# EAGLE schematic UCirKitBreadboard-08231908 (EAGLE 6.5.0), part 1 of 2
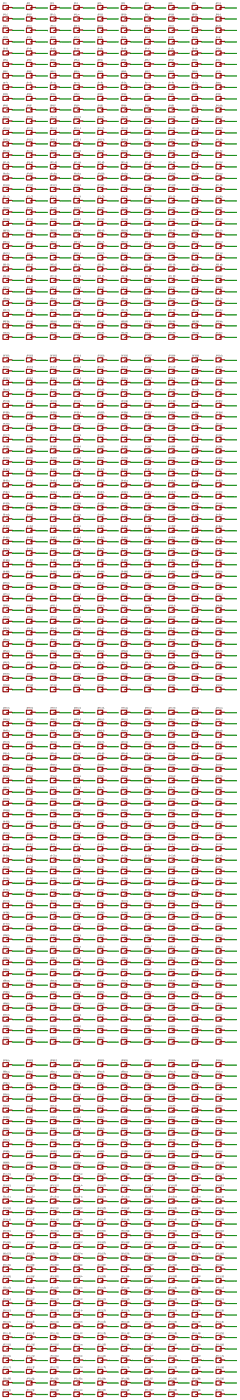
[diagram p0: schematic, sheet 1, overview]
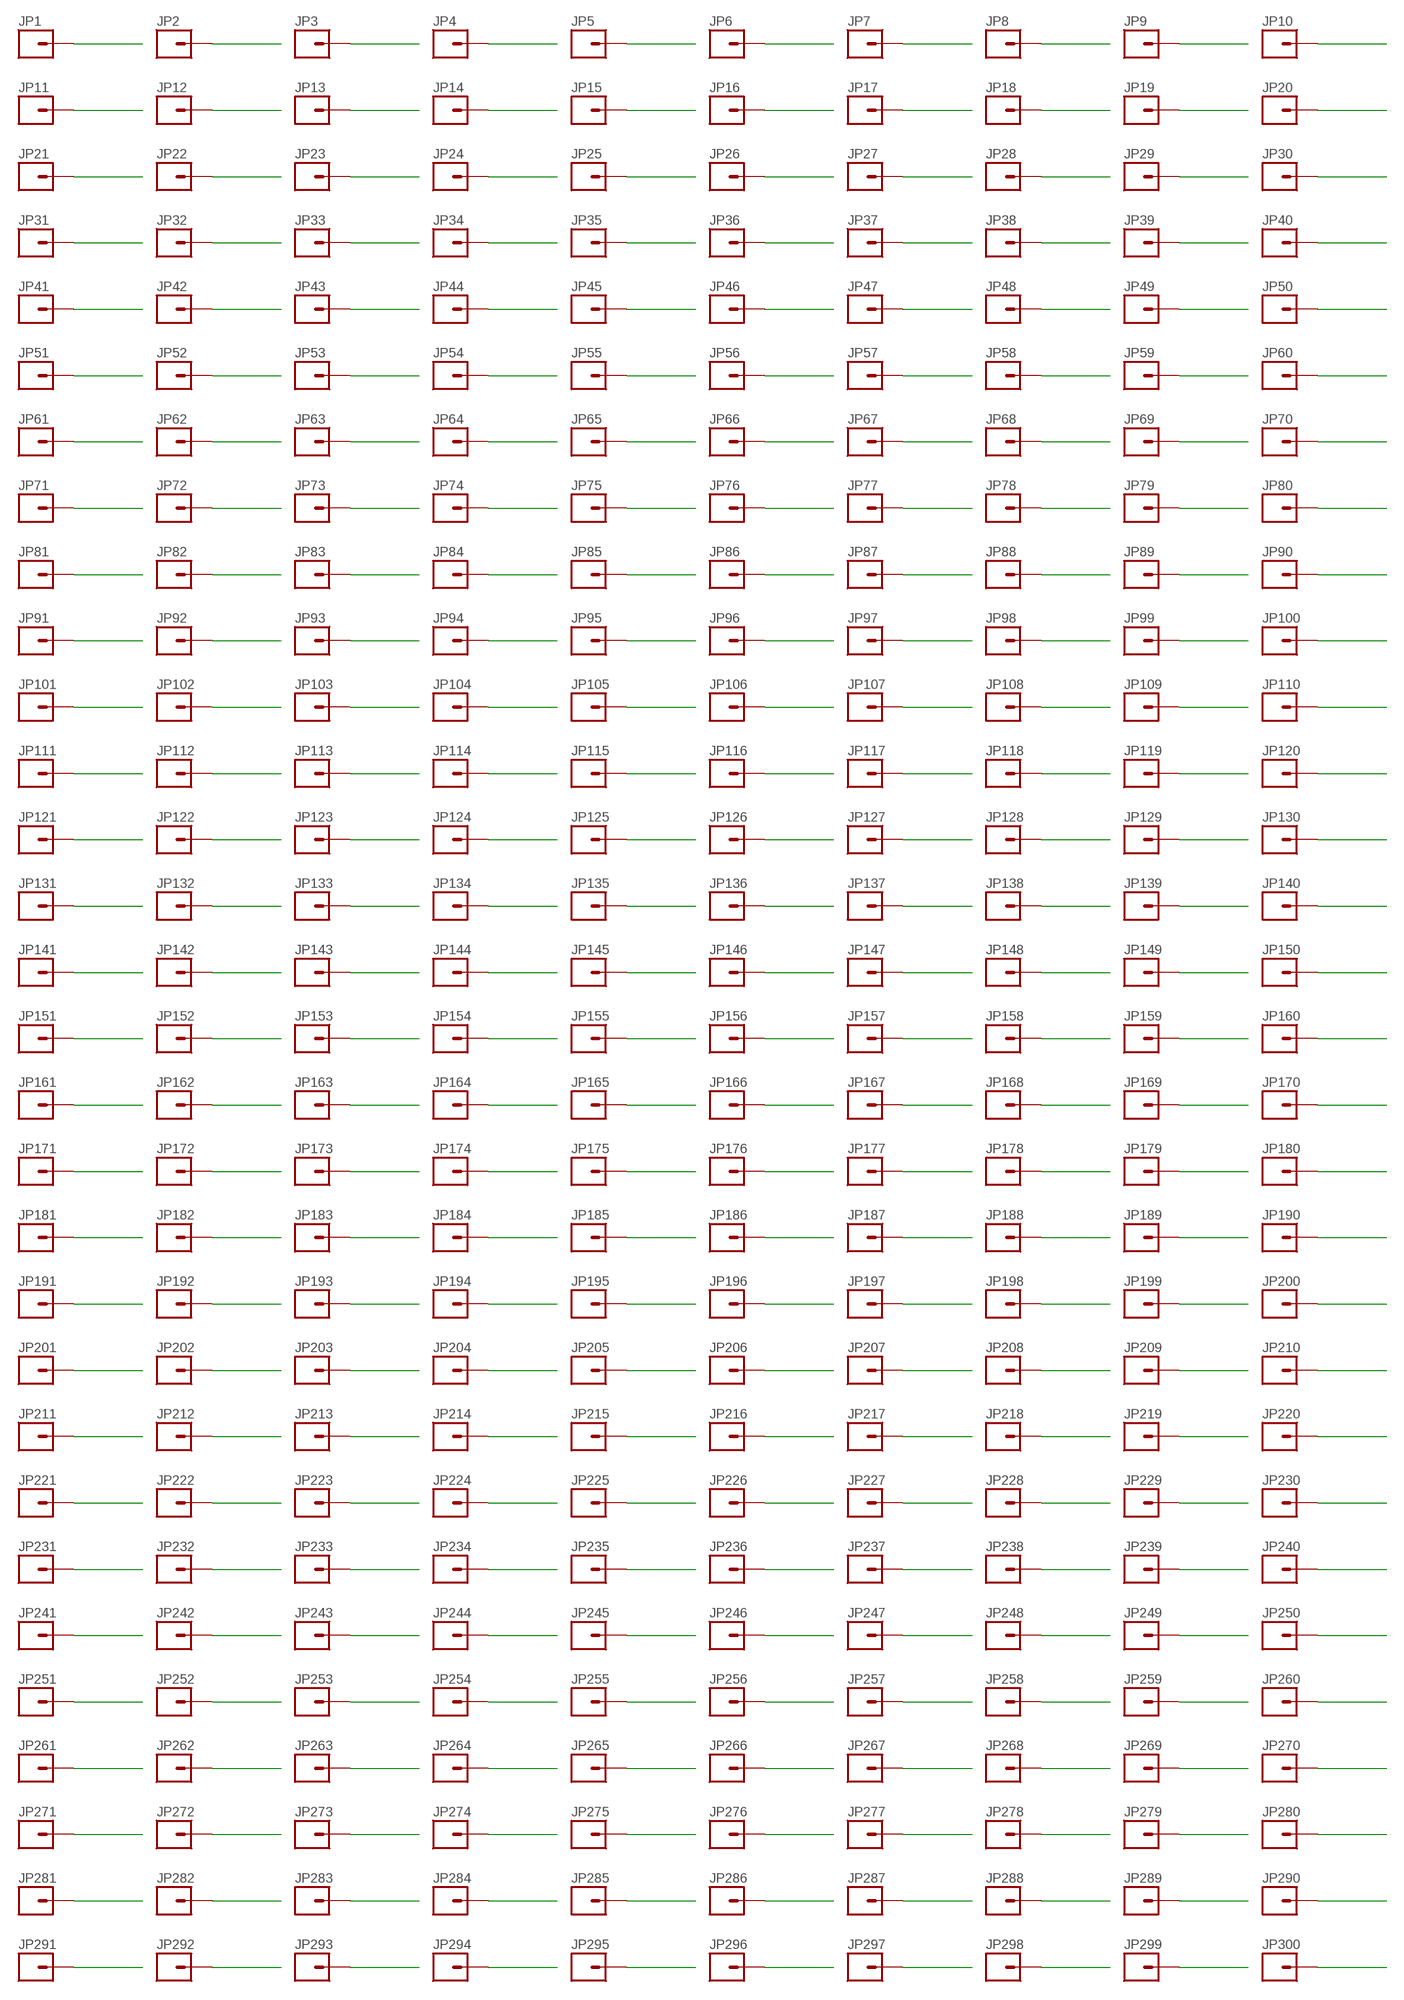
[diagram p1: schematic, sheet 1, part 1 of 4]
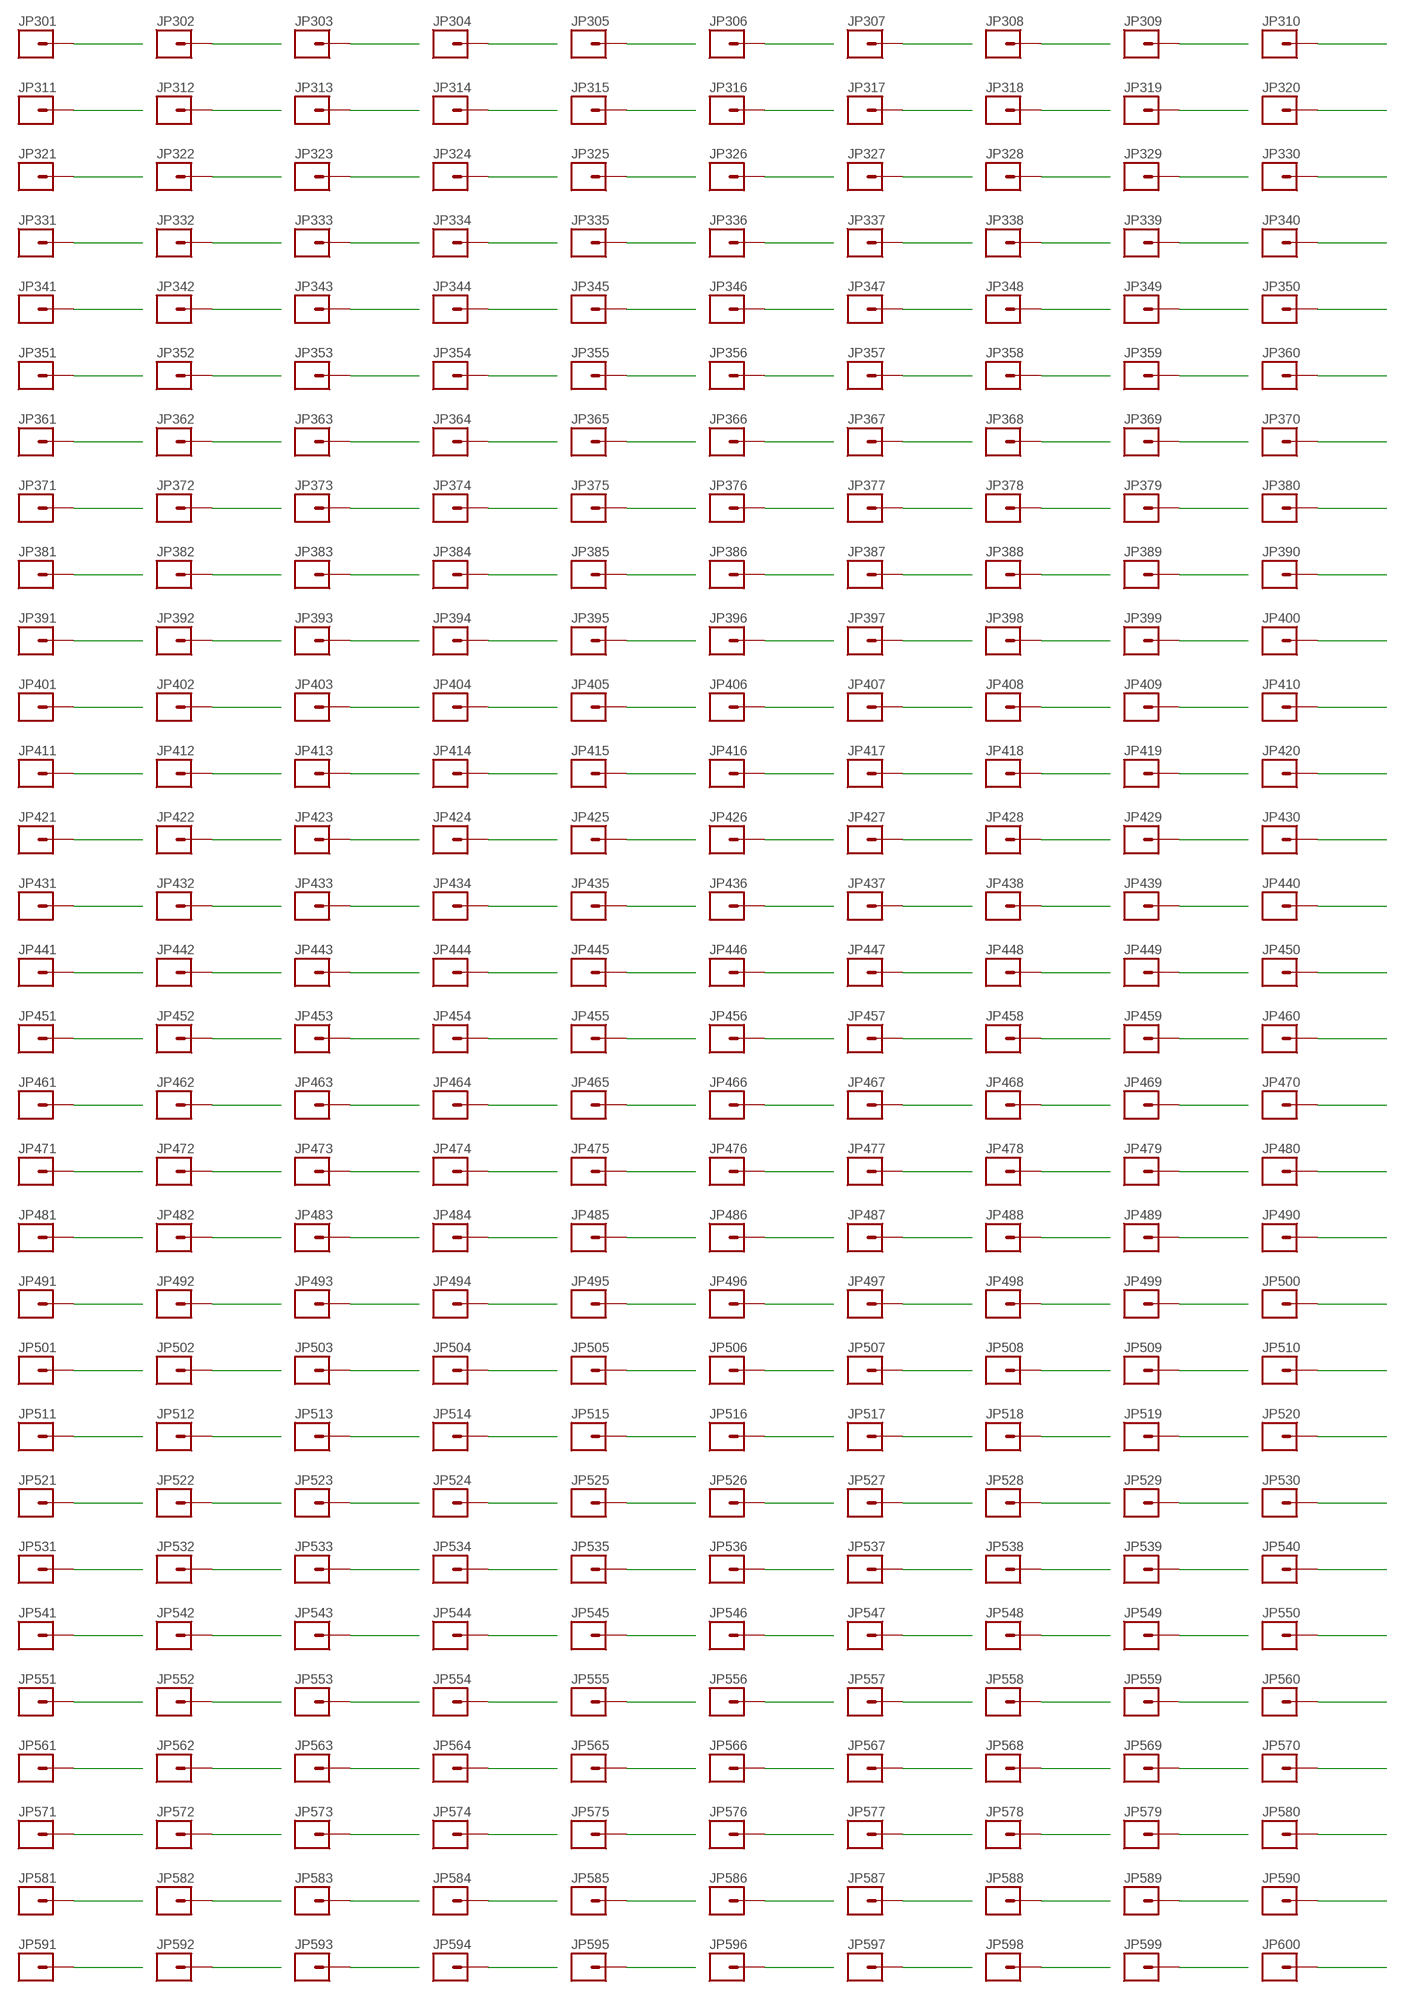
[diagram p2: schematic, sheet 1, part 2 of 4]
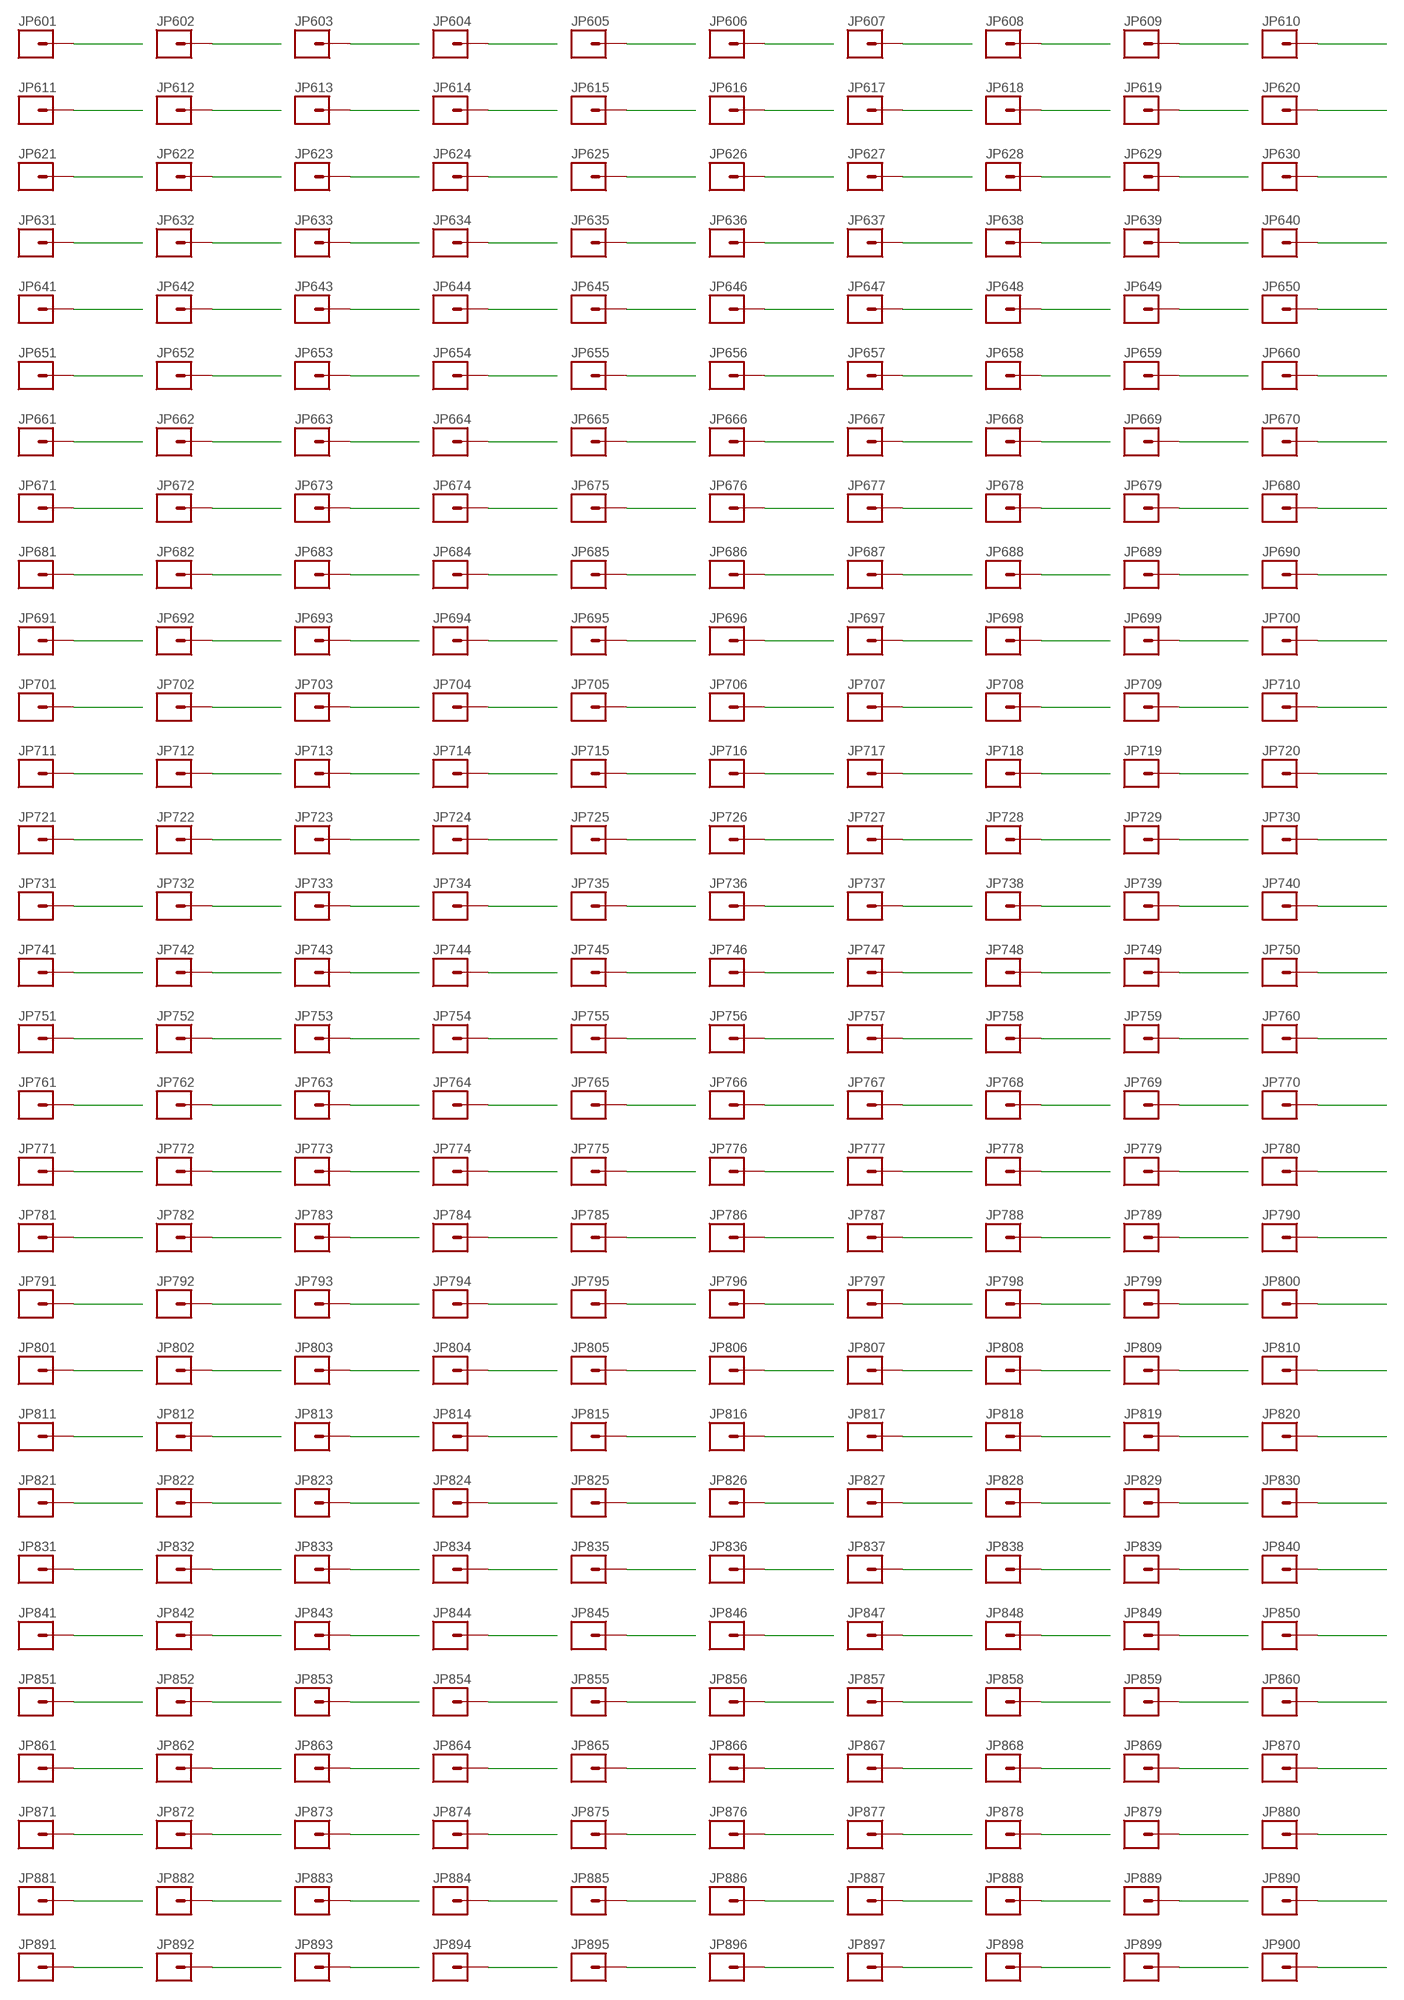
[diagram p3: schematic, sheet 1, part 3 of 4]
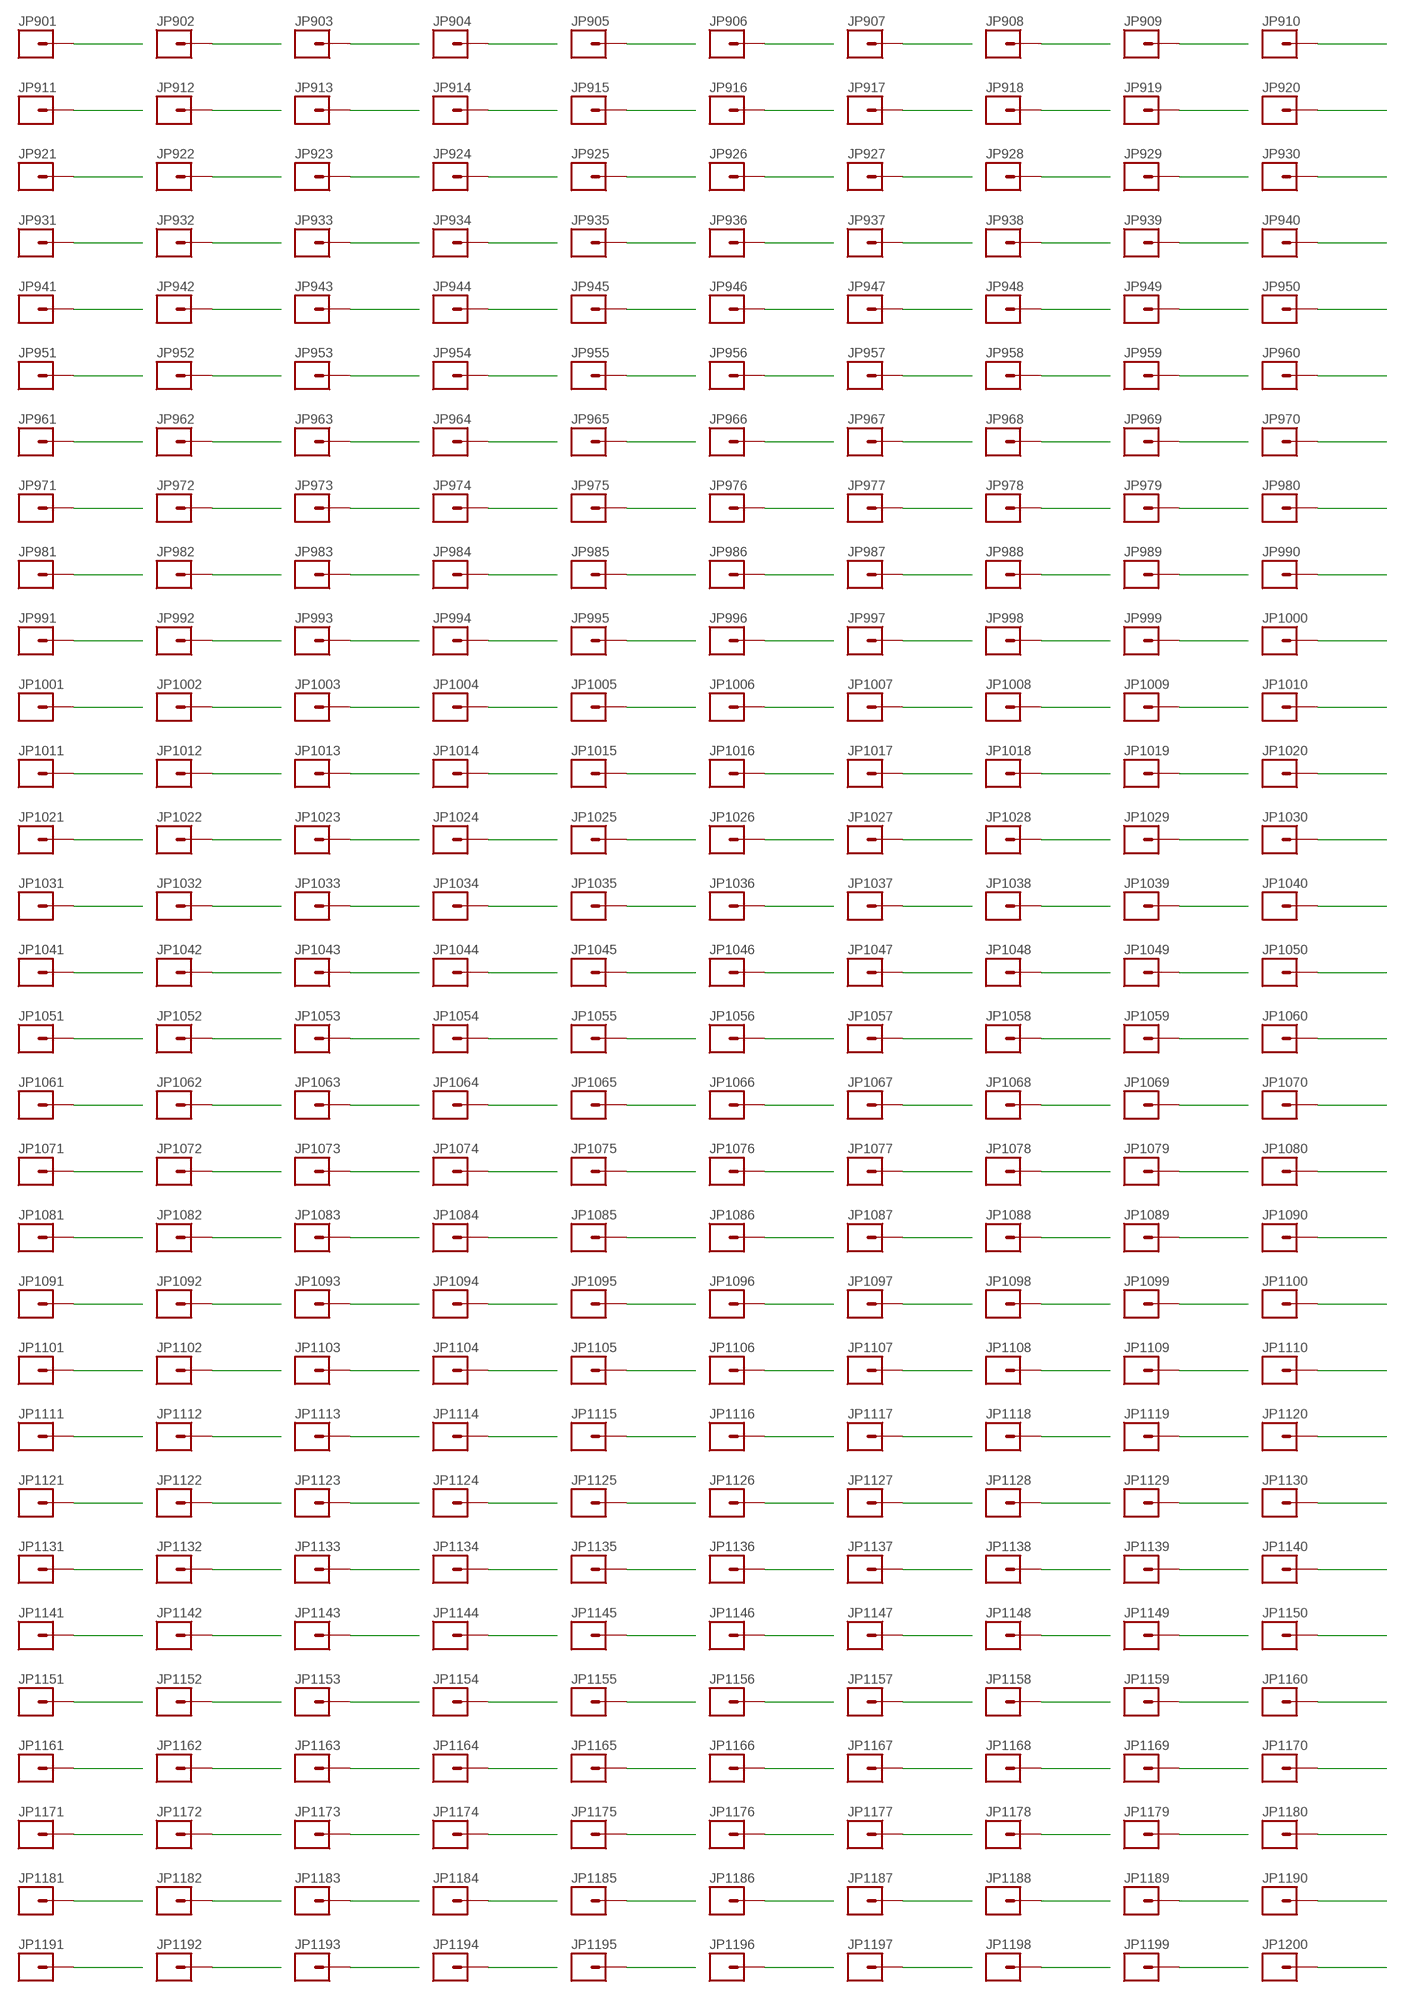
[diagram p4: schematic, sheet 1, part 4 of 4]

## Parts
JP1  M01PTH_WITHOUT_TEXT  [1X01_WITHOUT_TEXT]
JP2  M01PTH_WITHOUT_TEXT  [1X01_WITHOUT_TEXT]
JP3  M01PTH_WITHOUT_TEXT  [1X01_WITHOUT_TEXT]
JP4  M01PTH_WITHOUT_TEXT  [1X01_WITHOUT_TEXT]
JP5  M01PTH_WITHOUT_TEXT  [1X01_WITHOUT_TEXT]
JP6  M01PTH_WITHOUT_TEXT  [1X01_WITHOUT_TEXT]
JP7  M01PTH_WITHOUT_TEXT  [1X01_WITHOUT_TEXT]
JP8  M01PTH_WITHOUT_TEXT  [1X01_WITHOUT_TEXT]
JP9  M01PTH_WITHOUT_TEXT  [1X01_WITHOUT_TEXT]
JP10  M01PTH_WITHOUT_TEXT  [1X01_WITHOUT_TEXT]
JP11  M01PTH_WITHOUT_TEXT  [1X01_WITHOUT_TEXT]
JP12  M01PTH_WITHOUT_TEXT  [1X01_WITHOUT_TEXT]
JP13  M01PTH_WITHOUT_TEXT  [1X01_WITHOUT_TEXT]
JP14  M01PTH_WITHOUT_TEXT  [1X01_WITHOUT_TEXT]
JP15  M01PTH_WITHOUT_TEXT  [1X01_WITHOUT_TEXT]
JP16  M01PTH_WITHOUT_TEXT  [1X01_WITHOUT_TEXT]
JP17  M01PTH_WITHOUT_TEXT  [1X01_WITHOUT_TEXT]
JP18  M01PTH_WITHOUT_TEXT  [1X01_WITHOUT_TEXT]
JP19  M01PTH_WITHOUT_TEXT  [1X01_WITHOUT_TEXT]
JP20  M01PTH_WITHOUT_TEXT  [1X01_WITHOUT_TEXT]
JP21  M01PTH_WITHOUT_TEXT  [1X01_WITHOUT_TEXT]
JP22  M01PTH_WITHOUT_TEXT  [1X01_WITHOUT_TEXT]
JP23  M01PTH_WITHOUT_TEXT  [1X01_WITHOUT_TEXT]
JP24  M01PTH_WITHOUT_TEXT  [1X01_WITHOUT_TEXT]
JP25  M01PTH_WITHOUT_TEXT  [1X01_WITHOUT_TEXT]
JP26  M01PTH_WITHOUT_TEXT  [1X01_WITHOUT_TEXT]
JP27  M01PTH_WITHOUT_TEXT  [1X01_WITHOUT_TEXT]
JP28  M01PTH_WITHOUT_TEXT  [1X01_WITHOUT_TEXT]
JP29  M01PTH_WITHOUT_TEXT  [1X01_WITHOUT_TEXT]
JP30  M01PTH_WITHOUT_TEXT  [1X01_WITHOUT_TEXT]
JP31  M01PTH_WITHOUT_TEXT  [1X01_WITHOUT_TEXT]
JP32  M01PTH_WITHOUT_TEXT  [1X01_WITHOUT_TEXT]
JP33  M01PTH_WITHOUT_TEXT  [1X01_WITHOUT_TEXT]
JP34  M01PTH_WITHOUT_TEXT  [1X01_WITHOUT_TEXT]
JP35  M01PTH_WITHOUT_TEXT  [1X01_WITHOUT_TEXT]
JP36  M01PTH_WITHOUT_TEXT  [1X01_WITHOUT_TEXT]
JP37  M01PTH_WITHOUT_TEXT  [1X01_WITHOUT_TEXT]
JP38  M01PTH_WITHOUT_TEXT  [1X01_WITHOUT_TEXT]
JP39  M01PTH_WITHOUT_TEXT  [1X01_WITHOUT_TEXT]
JP40  M01PTH_WITHOUT_TEXT  [1X01_WITHOUT_TEXT]
JP41  M01PTH_WITHOUT_TEXT  [1X01_WITHOUT_TEXT]
JP42  M01PTH_WITHOUT_TEXT  [1X01_WITHOUT_TEXT]
JP43  M01PTH_WITHOUT_TEXT  [1X01_WITHOUT_TEXT]
JP44  M01PTH_WITHOUT_TEXT  [1X01_WITHOUT_TEXT]
JP45  M01PTH_WITHOUT_TEXT  [1X01_WITHOUT_TEXT]
JP46  M01PTH_WITHOUT_TEXT  [1X01_WITHOUT_TEXT]
JP47  M01PTH_WITHOUT_TEXT  [1X01_WITHOUT_TEXT]
JP48  M01PTH_WITHOUT_TEXT  [1X01_WITHOUT_TEXT]
JP49  M01PTH_WITHOUT_TEXT  [1X01_WITHOUT_TEXT]
JP50  M01PTH_WITHOUT_TEXT  [1X01_WITHOUT_TEXT]
JP51  M01PTH_WITHOUT_TEXT  [1X01_WITHOUT_TEXT]
JP52  M01PTH_WITHOUT_TEXT  [1X01_WITHOUT_TEXT]
JP53  M01PTH_WITHOUT_TEXT  [1X01_WITHOUT_TEXT]
JP54  M01PTH_WITHOUT_TEXT  [1X01_WITHOUT_TEXT]
JP55  M01PTH_WITHOUT_TEXT  [1X01_WITHOUT_TEXT]
JP56  M01PTH_WITHOUT_TEXT  [1X01_WITHOUT_TEXT]
JP57  M01PTH_WITHOUT_TEXT  [1X01_WITHOUT_TEXT]
JP58  M01PTH_WITHOUT_TEXT  [1X01_WITHOUT_TEXT]
JP59  M01PTH_WITHOUT_TEXT  [1X01_WITHOUT_TEXT]
JP60  M01PTH_WITHOUT_TEXT  [1X01_WITHOUT_TEXT]
JP61  M01PTH_WITHOUT_TEXT  [1X01_WITHOUT_TEXT]
JP62  M01PTH_WITHOUT_TEXT  [1X01_WITHOUT_TEXT]
JP63  M01PTH_WITHOUT_TEXT  [1X01_WITHOUT_TEXT]
JP64  M01PTH_WITHOUT_TEXT  [1X01_WITHOUT_TEXT]
JP65  M01PTH_WITHOUT_TEXT  [1X01_WITHOUT_TEXT]
JP66  M01PTH_WITHOUT_TEXT  [1X01_WITHOUT_TEXT]
JP67  M01PTH_WITHOUT_TEXT  [1X01_WITHOUT_TEXT]
JP68  M01PTH_WITHOUT_TEXT  [1X01_WITHOUT_TEXT]
JP69  M01PTH_WITHOUT_TEXT  [1X01_WITHOUT_TEXT]
JP70  M01PTH_WITHOUT_TEXT  [1X01_WITHOUT_TEXT]
JP71  M01PTH_WITHOUT_TEXT  [1X01_WITHOUT_TEXT]
JP72  M01PTH_WITHOUT_TEXT  [1X01_WITHOUT_TEXT]
JP73  M01PTH_WITHOUT_TEXT  [1X01_WITHOUT_TEXT]
JP74  M01PTH_WITHOUT_TEXT  [1X01_WITHOUT_TEXT]
JP75  M01PTH_WITHOUT_TEXT  [1X01_WITHOUT_TEXT]
JP76  M01PTH_WITHOUT_TEXT  [1X01_WITHOUT_TEXT]
JP77  M01PTH_WITHOUT_TEXT  [1X01_WITHOUT_TEXT]
JP78  M01PTH_WITHOUT_TEXT  [1X01_WITHOUT_TEXT]
JP79  M01PTH_WITHOUT_TEXT  [1X01_WITHOUT_TEXT]
JP80  M01PTH_WITHOUT_TEXT  [1X01_WITHOUT_TEXT]
JP81  M01PTH_WITHOUT_TEXT  [1X01_WITHOUT_TEXT]
JP82  M01PTH_WITHOUT_TEXT  [1X01_WITHOUT_TEXT]
JP83  M01PTH_WITHOUT_TEXT  [1X01_WITHOUT_TEXT]
JP84  M01PTH_WITHOUT_TEXT  [1X01_WITHOUT_TEXT]
JP85  M01PTH_WITHOUT_TEXT  [1X01_WITHOUT_TEXT]
JP86  M01PTH_WITHOUT_TEXT  [1X01_WITHOUT_TEXT]
JP87  M01PTH_WITHOUT_TEXT  [1X01_WITHOUT_TEXT]
JP88  M01PTH_WITHOUT_TEXT  [1X01_WITHOUT_TEXT]
JP89  M01PTH_WITHOUT_TEXT  [1X01_WITHOUT_TEXT]
JP90  M01PTH_WITHOUT_TEXT  [1X01_WITHOUT_TEXT]
JP91  M01PTH_WITHOUT_TEXT  [1X01_WITHOUT_TEXT]
JP92  M01PTH_WITHOUT_TEXT  [1X01_WITHOUT_TEXT]
JP93  M01PTH_WITHOUT_TEXT  [1X01_WITHOUT_TEXT]
JP94  M01PTH_WITHOUT_TEXT  [1X01_WITHOUT_TEXT]
JP95  M01PTH_WITHOUT_TEXT  [1X01_WITHOUT_TEXT]
JP96  M01PTH_WITHOUT_TEXT  [1X01_WITHOUT_TEXT]
JP97  M01PTH_WITHOUT_TEXT  [1X01_WITHOUT_TEXT]
JP98  M01PTH_WITHOUT_TEXT  [1X01_WITHOUT_TEXT]
JP99  M01PTH_WITHOUT_TEXT  [1X01_WITHOUT_TEXT]
JP100  M01PTH_WITHOUT_TEXT  [1X01_WITHOUT_TEXT]
JP101  M01PTH_WITHOUT_TEXT  [1X01_WITHOUT_TEXT]
JP102  M01PTH_WITHOUT_TEXT  [1X01_WITHOUT_TEXT]
JP103  M01PTH_WITHOUT_TEXT  [1X01_WITHOUT_TEXT]
JP104  M01PTH_WITHOUT_TEXT  [1X01_WITHOUT_TEXT]
JP105  M01PTH_WITHOUT_TEXT  [1X01_WITHOUT_TEXT]
JP106  M01PTH_WITHOUT_TEXT  [1X01_WITHOUT_TEXT]
JP107  M01PTH_WITHOUT_TEXT  [1X01_WITHOUT_TEXT]
JP108  M01PTH_WITHOUT_TEXT  [1X01_WITHOUT_TEXT]
JP109  M01PTH_WITHOUT_TEXT  [1X01_WITHOUT_TEXT]
JP110  M01PTH_WITHOUT_TEXT  [1X01_WITHOUT_TEXT]
JP111  M01PTH_WITHOUT_TEXT  [1X01_WITHOUT_TEXT]
JP112  M01PTH_WITHOUT_TEXT  [1X01_WITHOUT_TEXT]
JP113  M01PTH_WITHOUT_TEXT  [1X01_WITHOUT_TEXT]
JP114  M01PTH_WITHOUT_TEXT  [1X01_WITHOUT_TEXT]
JP115  M01PTH_WITHOUT_TEXT  [1X01_WITHOUT_TEXT]
JP116  M01PTH_WITHOUT_TEXT  [1X01_WITHOUT_TEXT]
JP117  M01PTH_WITHOUT_TEXT  [1X01_WITHOUT_TEXT]
JP118  M01PTH_WITHOUT_TEXT  [1X01_WITHOUT_TEXT]
JP119  M01PTH_WITHOUT_TEXT  [1X01_WITHOUT_TEXT]
JP120  M01PTH_WITHOUT_TEXT  [1X01_WITHOUT_TEXT]
JP121  M01PTH_WITHOUT_TEXT  [1X01_WITHOUT_TEXT]
JP122  M01PTH_WITHOUT_TEXT  [1X01_WITHOUT_TEXT]
JP123  M01PTH_WITHOUT_TEXT  [1X01_WITHOUT_TEXT]
JP124  M01PTH_WITHOUT_TEXT  [1X01_WITHOUT_TEXT]
JP125  M01PTH_WITHOUT_TEXT  [1X01_WITHOUT_TEXT]
JP126  M01PTH_WITHOUT_TEXT  [1X01_WITHOUT_TEXT]
JP127  M01PTH_WITHOUT_TEXT  [1X01_WITHOUT_TEXT]
JP128  M01PTH_WITHOUT_TEXT  [1X01_WITHOUT_TEXT]
JP129  M01PTH_WITHOUT_TEXT  [1X01_WITHOUT_TEXT]
JP130  M01PTH_WITHOUT_TEXT  [1X01_WITHOUT_TEXT]
JP131  M01PTH_WITHOUT_TEXT  [1X01_WITHOUT_TEXT]
JP132  M01PTH_WITHOUT_TEXT  [1X01_WITHOUT_TEXT]
JP133  M01PTH_WITHOUT_TEXT  [1X01_WITHOUT_TEXT]
JP134  M01PTH_WITHOUT_TEXT  [1X01_WITHOUT_TEXT]
JP135  M01PTH_WITHOUT_TEXT  [1X01_WITHOUT_TEXT]
JP136  M01PTH_WITHOUT_TEXT  [1X01_WITHOUT_TEXT]
JP137  M01PTH_WITHOUT_TEXT  [1X01_WITHOUT_TEXT]
JP138  M01PTH_WITHOUT_TEXT  [1X01_WITHOUT_TEXT]
JP139  M01PTH_WITHOUT_TEXT  [1X01_WITHOUT_TEXT]
JP140  M01PTH_WITHOUT_TEXT  [1X01_WITHOUT_TEXT]
JP141  M01PTH_WITHOUT_TEXT  [1X01_WITHOUT_TEXT]
JP142  M01PTH_WITHOUT_TEXT  [1X01_WITHOUT_TEXT]
JP143  M01PTH_WITHOUT_TEXT  [1X01_WITHOUT_TEXT]
JP144  M01PTH_WITHOUT_TEXT  [1X01_WITHOUT_TEXT]
JP145  M01PTH_WITHOUT_TEXT  [1X01_WITHOUT_TEXT]
JP146  M01PTH_WITHOUT_TEXT  [1X01_WITHOUT_TEXT]
JP147  M01PTH_WITHOUT_TEXT  [1X01_WITHOUT_TEXT]
JP148  M01PTH_WITHOUT_TEXT  [1X01_WITHOUT_TEXT]
JP149  M01PTH_WITHOUT_TEXT  [1X01_WITHOUT_TEXT]
JP150  M01PTH_WITHOUT_TEXT  [1X01_WITHOUT_TEXT]
JP151  M01PTH_WITHOUT_TEXT  [1X01_WITHOUT_TEXT]
JP152  M01PTH_WITHOUT_TEXT  [1X01_WITHOUT_TEXT]
JP153  M01PTH_WITHOUT_TEXT  [1X01_WITHOUT_TEXT]
JP154  M01PTH_WITHOUT_TEXT  [1X01_WITHOUT_TEXT]
JP155  M01PTH_WITHOUT_TEXT  [1X01_WITHOUT_TEXT]
JP156  M01PTH_WITHOUT_TEXT  [1X01_WITHOUT_TEXT]
JP157  M01PTH_WITHOUT_TEXT  [1X01_WITHOUT_TEXT]
JP158  M01PTH_WITHOUT_TEXT  [1X01_WITHOUT_TEXT]
JP159  M01PTH_WITHOUT_TEXT  [1X01_WITHOUT_TEXT]
JP160  M01PTH_WITHOUT_TEXT  [1X01_WITHOUT_TEXT]
JP161  M01PTH_WITHOUT_TEXT  [1X01_WITHOUT_TEXT]
JP162  M01PTH_WITHOUT_TEXT  [1X01_WITHOUT_TEXT]
JP163  M01PTH_WITHOUT_TEXT  [1X01_WITHOUT_TEXT]
JP164  M01PTH_WITHOUT_TEXT  [1X01_WITHOUT_TEXT]
JP165  M01PTH_WITHOUT_TEXT  [1X01_WITHOUT_TEXT]
JP166  M01PTH_WITHOUT_TEXT  [1X01_WITHOUT_TEXT]
JP167  M01PTH_WITHOUT_TEXT  [1X01_WITHOUT_TEXT]
JP168  M01PTH_WITHOUT_TEXT  [1X01_WITHOUT_TEXT]
JP169  M01PTH_WITHOUT_TEXT  [1X01_WITHOUT_TEXT]
JP170  M01PTH_WITHOUT_TEXT  [1X01_WITHOUT_TEXT]
JP171  M01PTH_WITHOUT_TEXT  [1X01_WITHOUT_TEXT]
JP172  M01PTH_WITHOUT_TEXT  [1X01_WITHOUT_TEXT]
JP173  M01PTH_WITHOUT_TEXT  [1X01_WITHOUT_TEXT]
JP174  M01PTH_WITHOUT_TEXT  [1X01_WITHOUT_TEXT]
JP175  M01PTH_WITHOUT_TEXT  [1X01_WITHOUT_TEXT]
JP176  M01PTH_WITHOUT_TEXT  [1X01_WITHOUT_TEXT]
JP177  M01PTH_WITHOUT_TEXT  [1X01_WITHOUT_TEXT]
JP178  M01PTH_WITHOUT_TEXT  [1X01_WITHOUT_TEXT]
JP179  M01PTH_WITHOUT_TEXT  [1X01_WITHOUT_TEXT]
JP180  M01PTH_WITHOUT_TEXT  [1X01_WITHOUT_TEXT]
JP181  M01PTH_WITHOUT_TEXT  [1X01_WITHOUT_TEXT]
JP182  M01PTH_WITHOUT_TEXT  [1X01_WITHOUT_TEXT]
JP183  M01PTH_WITHOUT_TEXT  [1X01_WITHOUT_TEXT]
JP184  M01PTH_WITHOUT_TEXT  [1X01_WITHOUT_TEXT]
JP185  M01PTH_WITHOUT_TEXT  [1X01_WITHOUT_TEXT]
JP186  M01PTH_WITHOUT_TEXT  [1X01_WITHOUT_TEXT]
JP187  M01PTH_WITHOUT_TEXT  [1X01_WITHOUT_TEXT]
JP188  M01PTH_WITHOUT_TEXT  [1X01_WITHOUT_TEXT]
JP189  M01PTH_WITHOUT_TEXT  [1X01_WITHOUT_TEXT]
JP190  M01PTH_WITHOUT_TEXT  [1X01_WITHOUT_TEXT]
JP191  M01PTH_WITHOUT_TEXT  [1X01_WITHOUT_TEXT]
JP192  M01PTH_WITHOUT_TEXT  [1X01_WITHOUT_TEXT]
JP193  M01PTH_WITHOUT_TEXT  [1X01_WITHOUT_TEXT]
JP194  M01PTH_WITHOUT_TEXT  [1X01_WITHOUT_TEXT]
JP195  M01PTH_WITHOUT_TEXT  [1X01_WITHOUT_TEXT]
JP196  M01PTH_WITHOUT_TEXT  [1X01_WITHOUT_TEXT]
JP197  M01PTH_WITHOUT_TEXT  [1X01_WITHOUT_TEXT]
JP198  M01PTH_WITHOUT_TEXT  [1X01_WITHOUT_TEXT]
JP199  M01PTH_WITHOUT_TEXT  [1X01_WITHOUT_TEXT]
JP200  M01PTH_WITHOUT_TEXT  [1X01_WITHOUT_TEXT]
JP201  M01PTH_WITHOUT_TEXT  [1X01_WITHOUT_TEXT]
JP202  M01PTH_WITHOUT_TEXT  [1X01_WITHOUT_TEXT]
JP203  M01PTH_WITHOUT_TEXT  [1X01_WITHOUT_TEXT]
JP204  M01PTH_WITHOUT_TEXT  [1X01_WITHOUT_TEXT]
JP205  M01PTH_WITHOUT_TEXT  [1X01_WITHOUT_TEXT]
JP206  M01PTH_WITHOUT_TEXT  [1X01_WITHOUT_TEXT]
JP207  M01PTH_WITHOUT_TEXT  [1X01_WITHOUT_TEXT]
JP208  M01PTH_WITHOUT_TEXT  [1X01_WITHOUT_TEXT]
JP209  M01PTH_WITHOUT_TEXT  [1X01_WITHOUT_TEXT]
JP210  M01PTH_WITHOUT_TEXT  [1X01_WITHOUT_TEXT]
JP211  M01PTH_WITHOUT_TEXT  [1X01_WITHOUT_TEXT]
JP212  M01PTH_WITHOUT_TEXT  [1X01_WITHOUT_TEXT]
JP213  M01PTH_WITHOUT_TEXT  [1X01_WITHOUT_TEXT]
JP214  M01PTH_WITHOUT_TEXT  [1X01_WITHOUT_TEXT]
JP215  M01PTH_WITHOUT_TEXT  [1X01_WITHOUT_TEXT]
JP216  M01PTH_WITHOUT_TEXT  [1X01_WITHOUT_TEXT]
JP217  M01PTH_WITHOUT_TEXT  [1X01_WITHOUT_TEXT]
JP218  M01PTH_WITHOUT_TEXT  [1X01_WITHOUT_TEXT]
JP219  M01PTH_WITHOUT_TEXT  [1X01_WITHOUT_TEXT]
JP220  M01PTH_WITHOUT_TEXT  [1X01_WITHOUT_TEXT]
JP221  M01PTH_WITHOUT_TEXT  [1X01_WITHOUT_TEXT]
JP222  M01PTH_WITHOUT_TEXT  [1X01_WITHOUT_TEXT]
JP223  M01PTH_WITHOUT_TEXT  [1X01_WITHOUT_TEXT]
JP224  M01PTH_WITHOUT_TEXT  [1X01_WITHOUT_TEXT]
JP225  M01PTH_WITHOUT_TEXT  [1X01_WITHOUT_TEXT]
JP226  M01PTH_WITHOUT_TEXT  [1X01_WITHOUT_TEXT]
JP227  M01PTH_WITHOUT_TEXT  [1X01_WITHOUT_TEXT]
JP228  M01PTH_WITHOUT_TEXT  [1X01_WITHOUT_TEXT]
JP229  M01PTH_WITHOUT_TEXT  [1X01_WITHOUT_TEXT]
JP230  M01PTH_WITHOUT_TEXT  [1X01_WITHOUT_TEXT]
JP231  M01PTH_WITHOUT_TEXT  [1X01_WITHOUT_TEXT]
JP232  M01PTH_WITHOUT_TEXT  [1X01_WITHOUT_TEXT]
JP233  M01PTH_WITHOUT_TEXT  [1X01_WITHOUT_TEXT]
JP234  M01PTH_WITHOUT_TEXT  [1X01_WITHOUT_TEXT]
JP235  M01PTH_WITHOUT_TEXT  [1X01_WITHOUT_TEXT]
JP236  M01PTH_WITHOUT_TEXT  [1X01_WITHOUT_TEXT]
JP237  M01PTH_WITHOUT_TEXT  [1X01_WITHOUT_TEXT]
JP238  M01PTH_WITHOUT_TEXT  [1X01_WITHOUT_TEXT]
JP239  M01PTH_WITHOUT_TEXT  [1X01_WITHOUT_TEXT]
JP240  M01PTH_WITHOUT_TEXT  [1X01_WITHOUT_TEXT]
JP241  M01PTH_WITHOUT_TEXT  [1X01_WITHOUT_TEXT]
JP242  M01PTH_WITHOUT_TEXT  [1X01_WITHOUT_TEXT]
JP243  M01PTH_WITHOUT_TEXT  [1X01_WITHOUT_TEXT]
JP244  M01PTH_WITHOUT_TEXT  [1X01_WITHOUT_TEXT]
JP245  M01PTH_WITHOUT_TEXT  [1X01_WITHOUT_TEXT]
JP246  M01PTH_WITHOUT_TEXT  [1X01_WITHOUT_TEXT]
JP247  M01PTH_WITHOUT_TEXT  [1X01_WITHOUT_TEXT]
JP248  M01PTH_WITHOUT_TEXT  [1X01_WITHOUT_TEXT]
JP249  M01PTH_WITHOUT_TEXT  [1X01_WITHOUT_TEXT]
JP250  M01PTH_WITHOUT_TEXT  [1X01_WITHOUT_TEXT]
JP251  M01PTH_WITHOUT_TEXT  [1X01_WITHOUT_TEXT]
JP252  M01PTH_WITHOUT_TEXT  [1X01_WITHOUT_TEXT]
JP253  M01PTH_WITHOUT_TEXT  [1X01_WITHOUT_TEXT]
JP254  M01PTH_WITHOUT_TEXT  [1X01_WITHOUT_TEXT]
JP255  M01PTH_WITHOUT_TEXT  [1X01_WITHOUT_TEXT]
JP256  M01PTH_WITHOUT_TEXT  [1X01_WITHOUT_TEXT]
JP257  M01PTH_WITHOUT_TEXT  [1X01_WITHOUT_TEXT]
JP258  M01PTH_WITHOUT_TEXT  [1X01_WITHOUT_TEXT]
JP259  M01PTH_WITHOUT_TEXT  [1X01_WITHOUT_TEXT]
JP260  M01PTH_WITHOUT_TEXT  [1X01_WITHOUT_TEXT]
JP261  M01PTH_WITHOUT_TEXT  [1X01_WITHOUT_TEXT]
JP262  M01PTH_WITHOUT_TEXT  [1X01_WITHOUT_TEXT]
JP263  M01PTH_WITHOUT_TEXT  [1X01_WITHOUT_TEXT]
JP264  M01PTH_WITHOUT_TEXT  [1X01_WITHOUT_TEXT]
JP265  M01PTH_WITHOUT_TEXT  [1X01_WITHOUT_TEXT]
JP266  M01PTH_WITHOUT_TEXT  [1X01_WITHOUT_TEXT]
JP267  M01PTH_WITHOUT_TEXT  [1X01_WITHOUT_TEXT]
JP268  M01PTH_WITHOUT_TEXT  [1X01_WITHOUT_TEXT]
JP269  M01PTH_WITHOUT_TEXT  [1X01_WITHOUT_TEXT]
JP270  M01PTH_WITHOUT_TEXT  [1X01_WITHOUT_TEXT]
JP271  M01PTH_WITHOUT_TEXT  [1X01_WITHOUT_TEXT]
JP272  M01PTH_WITHOUT_TEXT  [1X01_WITHOUT_TEXT]
JP273  M01PTH_WITHOUT_TEXT  [1X01_WITHOUT_TEXT]
JP274  M01PTH_WITHOUT_TEXT  [1X01_WITHOUT_TEXT]
JP275  M01PTH_WITHOUT_TEXT  [1X01_WITHOUT_TEXT]
JP276  M01PTH_WITHOUT_TEXT  [1X01_WITHOUT_TEXT]
JP277  M01PTH_WITHOUT_TEXT  [1X01_WITHOUT_TEXT]
JP278  M01PTH_WITHOUT_TEXT  [1X01_WITHOUT_TEXT]
JP279  M01PTH_WITHOUT_TEXT  [1X01_WITHOUT_TEXT]
JP280  M01PTH_WITHOUT_TEXT  [1X01_WITHOUT_TEXT]
JP281  M01PTH_WITHOUT_TEXT  [1X01_WITHOUT_TEXT]
JP282  M01PTH_WITHOUT_TEXT  [1X01_WITHOUT_TEXT]
JP283  M01PTH_WITHOUT_TEXT  [1X01_WITHOUT_TEXT]
JP284  M01PTH_WITHOUT_TEXT  [1X01_WITHOUT_TEXT]
JP285  M01PTH_WITHOUT_TEXT  [1X01_WITHOUT_TEXT]
JP286  M01PTH_WITHOUT_TEXT  [1X01_WITHOUT_TEXT]
JP287  M01PTH_WITHOUT_TEXT  [1X01_WITHOUT_TEXT]
JP288  M01PTH_WITHOUT_TEXT  [1X01_WITHOUT_TEXT]
JP289  M01PTH_WITHOUT_TEXT  [1X01_WITHOUT_TEXT]
JP290  M01PTH_WITHOUT_TEXT  [1X01_WITHOUT_TEXT]
JP291  M01PTH_WITHOUT_TEXT  [1X01_WITHOUT_TEXT]
JP292  M01PTH_WITHOUT_TEXT  [1X01_WITHOUT_TEXT]
JP293  M01PTH_WITHOUT_TEXT  [1X01_WITHOUT_TEXT]
JP294  M01PTH_WITHOUT_TEXT  [1X01_WITHOUT_TEXT]
JP295  M01PTH_WITHOUT_TEXT  [1X01_WITHOUT_TEXT]
JP296  M01PTH_WITHOUT_TEXT  [1X01_WITHOUT_TEXT]
JP297  M01PTH_WITHOUT_TEXT  [1X01_WITHOUT_TEXT]
JP298  M01PTH_WITHOUT_TEXT  [1X01_WITHOUT_TEXT]
JP299  M01PTH_WITHOUT_TEXT  [1X01_WITHOUT_TEXT]
JP300  M01PTH_WITHOUT_TEXT  [1X01_WITHOUT_TEXT]
JP301  M01PTH_SMD_3.25X0.85MM_NO_SILK  [1X01_SMD_3.25X0.85MM_NO_SILK]
JP302  M01PTH_SMD_3.25X0.85MM_NO_SILK  [1X01_SMD_3.25X0.85MM_NO_SILK]
JP303  M01PTH_SMD_3.25X0.85MM_NO_SILK  [1X01_SMD_3.25X0.85MM_NO_SILK]
JP304  M01PTH_SMD_3.25X0.85MM_NO_SILK  [1X01_SMD_3.25X0.85MM_NO_SILK]
JP305  M01PTH_SMD_3.25X0.85MM_NO_SILK  [1X01_SMD_3.25X0.85MM_NO_SILK]
JP306  M01PTH_SMD_3.25X0.85MM_NO_SILK  [1X01_SMD_3.25X0.85MM_NO_SILK]
JP307  M01PTH_SMD_3.25X0.85MM_NO_SILK  [1X01_SMD_3.25X0.85MM_NO_SILK]
JP308  M01PTH_SMD_3.25X0.85MM_NO_SILK  [1X01_SMD_3.25X0.85MM_NO_SILK]
JP309  M01PTH_SMD_3.25X0.85MM_NO_SILK  [1X01_SMD_3.25X0.85MM_NO_SILK]
JP310  M01PTH_SMD_3.25X0.85MM_NO_SILK  [1X01_SMD_3.25X0.85MM_NO_SILK]
JP311  M01PTH_SMD_3.25X0.85MM_NO_SILK  [1X01_SMD_3.25X0.85MM_NO_SILK]
JP312  M01PTH_SMD_3.25X0.85MM_NO_SILK  [1X01_SMD_3.25X0.85MM_NO_SILK]
JP313  M01PTH_SMD_3.25X0.85MM_NO_SILK  [1X01_SMD_3.25X0.85MM_NO_SILK]
JP314  M01PTH_SMD_3.25X0.85MM_NO_SILK  [1X01_SMD_3.25X0.85MM_NO_SILK]
JP315  M01PTH_SMD_3.25X0.85MM_NO_SILK  [1X01_SMD_3.25X0.85MM_NO_SILK]
JP316  M01PTH_SMD_3.25X0.85MM_NO_SILK  [1X01_SMD_3.25X0.85MM_NO_SILK]
JP317  M01PTH_SMD_3.25X0.85MM_NO_SILK  [1X01_SMD_3.25X0.85MM_NO_SILK]
JP318  M01PTH_SMD_3.25X0.85MM_NO_SILK  [1X01_SMD_3.25X0.85MM_NO_SILK]
JP319  M01PTH_SMD_3.25X0.85MM_NO_SILK  [1X01_SMD_3.25X0.85MM_NO_SILK]
JP320  M01PTH_SMD_3.25X0.85MM_NO_SILK  [1X01_SMD_3.25X0.85MM_NO_SILK]
JP321  M01PTH_SMD_3.25X0.85MM_NO_SILK  [1X01_SMD_3.25X0.85MM_NO_SILK]
JP322  M01PTH_SMD_3.25X0.85MM_NO_SILK  [1X01_SMD_3.25X0.85MM_NO_SILK]
JP323  M01PTH_SMD_3.25X0.85MM_NO_SILK  [1X01_SMD_3.25X0.85MM_NO_SILK]
JP324  M01PTH_SMD_3.25X0.85MM_NO_SILK  [1X01_SMD_3.25X0.85MM_NO_SILK]
JP325  M01PTH_SMD_3.25X0.85MM_NO_SILK  [1X01_SMD_3.25X0.85MM_NO_SILK]
JP326  M01PTH_SMD_3.25X0.85MM_NO_SILK  [1X01_SMD_3.25X0.85MM_NO_SILK]
JP327  M01PTH_SMD_3.25X0.85MM_NO_SILK  [1X01_SMD_3.25X0.85MM_NO_SILK]
JP328  M01PTH_SMD_3.25X0.85MM_NO_SILK  [1X01_SMD_3.25X0.85MM_NO_SILK]
JP329  M01PTH_SMD_3.25X0.85MM_NO_SILK  [1X01_SMD_3.25X0.85MM_NO_SILK]
JP330  M01PTH_SMD_3.25X0.85MM_NO_SILK  [1X01_SMD_3.25X0.85MM_NO_SILK]
JP331  M01PTH_SMD_3.25X0.85MM_NO_SILK  [1X01_SMD_3.25X0.85MM_NO_SILK]
JP332  M01PTH_SMD_3.25X0.85MM_NO_SILK  [1X01_SMD_3.25X0.85MM_NO_SILK]
JP333  M01PTH_SMD_3.25X0.85MM_NO_SILK  [1X01_SMD_3.25X0.85MM_NO_SILK]
JP334  M01PTH_SMD_3.25X0.85MM_NO_SILK  [1X01_SMD_3.25X0.85MM_NO_SILK]
JP335  M01PTH_SMD_3.25X0.85MM_NO_SILK  [1X01_SMD_3.25X0.85MM_NO_SILK]
JP336  M01PTH_SMD_3.25X0.85MM_NO_SILK  [1X01_SMD_3.25X0.85MM_NO_SILK]
JP337  M01PTH_SMD_3.25X0.85MM_NO_SILK  [1X01_SMD_3.25X0.85MM_NO_SILK]
JP338  M01PTH_SMD_3.25X0.85MM_NO_SILK  [1X01_SMD_3.25X0.85MM_NO_SILK]
JP339  M01PTH_SMD_3.25X0.85MM_NO_SILK  [1X01_SMD_3.25X0.85MM_NO_SILK]
JP340  M01PTH_SMD_3.25X0.85MM_NO_SILK  [1X01_SMD_3.25X0.85MM_NO_SILK]
JP341  M01PTH_SMD_3.25X0.85MM_NO_SILK  [1X01_SMD_3.25X0.85MM_NO_SILK]
JP342  M01PTH_SMD_3.25X0.85MM_NO_SILK  [1X01_SMD_3.25X0.85MM_NO_SILK]
JP343  M01PTH_SMD_3.25X0.85MM_NO_SILK  [1X01_SMD_3.25X0.85MM_NO_SILK]
JP344  M01PTH_SMD_3.25X0.85MM_NO_SILK  [1X01_SMD_3.25X0.85MM_NO_SILK]
JP345  M01PTH_SMD_3.25X0.85MM_NO_SILK  [1X01_SMD_3.25X0.85MM_NO_SILK]
JP346  M01PTH_SMD_3.25X0.85MM_NO_SILK  [1X01_SMD_3.25X0.85MM_NO_SILK]
JP347  M01PTH_SMD_3.25X0.85MM_NO_SILK  [1X01_SMD_3.25X0.85MM_NO_SILK]
JP348  M01PTH_SMD_3.25X0.85MM_NO_SILK  [1X01_SMD_3.25X0.85MM_NO_SILK]
JP349  M01PTH_SMD_3.25X0.85MM_NO_SILK  [1X01_SMD_3.25X0.85MM_NO_SILK]
JP350  M01PTH_SMD_3.25X0.85MM_NO_SILK  [1X01_SMD_3.25X0.85MM_NO_SILK]
JP351  M01PTH_SMD_3.25X0.85MM_NO_SILK  [1X01_SMD_3.25X0.85MM_NO_SILK]
JP352  M01PTH_SMD_3.25X0.85MM_NO_SILK  [1X01_SMD_3.25X0.85MM_NO_SILK]
JP353  M01PTH_SMD_3.25X0.85MM_NO_SILK  [1X01_SMD_3.25X0.85MM_NO_SILK]
JP354  M01PTH_SMD_3.25X0.85MM_NO_SILK  [1X01_SMD_3.25X0.85MM_NO_SILK]
JP355  M01PTH_SMD_3.25X0.85MM_NO_SILK  [1X01_SMD_3.25X0.85MM_NO_SILK]
JP356  M01PTH_SMD_3.25X0.85MM_NO_SILK  [1X01_SMD_3.25X0.85MM_NO_SILK]
JP357  M01PTH_SMD_3.25X0.85MM_NO_SILK  [1X01_SMD_3.25X0.85MM_NO_SILK]
JP358  M01PTH_SMD_3.25X0.85MM_NO_SILK  [1X01_SMD_3.25X0.85MM_NO_SILK]
JP359  M01PTH_SMD_3.25X0.85MM_NO_SILK  [1X01_SMD_3.25X0.85MM_NO_SILK]
JP360  M01PTH_SMD_3.25X0.85MM_NO_SILK  [1X01_SMD_3.25X0.85MM_NO_SILK]
JP361  M01PTH_SMD_3.25X0.85MM_NO_SILK  [1X01_SMD_3.25X0.85MM_NO_SILK]
JP362  M01PTH_SMD_3.25X0.85MM_NO_SILK  [1X01_SMD_3.25X0.85MM_NO_SILK]
JP363  M01PTH_SMD_3.25X0.85MM_NO_SILK  [1X01_SMD_3.25X0.85MM_NO_SILK]
JP364  M01PTH_SMD_3.25X0.85MM_NO_SILK  [1X01_SMD_3.25X0.85MM_NO_SILK]
JP365  M01PTH_SMD_3.25X0.85MM_NO_SILK  [1X01_SMD_3.25X0.85MM_NO_SILK]
JP366  M01PTH_SMD_3.25X0.85MM_NO_SILK  [1X01_SMD_3.25X0.85MM_NO_SILK]
JP367  M01PTH_SMD_3.25X0.85MM_NO_SILK  [1X01_SMD_3.25X0.85MM_NO_SILK]
JP368  M01PTH_SMD_3.25X0.85MM_NO_SILK  [1X01_SMD_3.25X0.85MM_NO_SILK]
JP369  M01PTH_SMD_3.25X0.85MM_NO_SILK  [1X01_SMD_3.25X0.85MM_NO_SILK]
JP370  M01PTH_SMD_3.25X0.85MM_NO_SILK  [1X01_SMD_3.25X0.85MM_NO_SILK]
JP371  M01PTH_SMD_3.25X0.85MM_NO_SILK  [1X01_SMD_3.25X0.85MM_NO_SILK]
JP372  M01PTH_SMD_3.25X0.85MM_NO_SILK  [1X01_SMD_3.25X0.85MM_NO_SILK]
JP373  M01PTH_SMD_3.25X0.85MM_NO_SILK  [1X01_SMD_3.25X0.85MM_NO_SILK]
JP374  M01PTH_SMD_3.25X0.85MM_NO_SILK  [1X01_SMD_3.25X0.85MM_NO_SILK]
JP375  M01PTH_SMD_3.25X0.85MM_NO_SILK  [1X01_SMD_3.25X0.85MM_NO_SILK]
JP376  M01PTH_SMD_3.25X0.85MM_NO_SILK  [1X01_SMD_3.25X0.85MM_NO_SILK]
JP377  M01PTH_SMD_3.25X0.85MM_NO_SILK  [1X01_SMD_3.25X0.85MM_NO_SILK]
JP378  M01PTH_SMD_3.25X0.85MM_NO_SILK  [1X01_SMD_3.25X0.85MM_NO_SILK]
JP379  M01PTH_SMD_3.25X0.85MM_NO_SILK  [1X01_SMD_3.25X0.85MM_NO_SILK]
JP380  M01PTH_SMD_3.25X0.85MM_NO_SILK  [1X01_SMD_3.25X0.85MM_NO_SILK]
JP381  M01PTH_SMD_3.25X0.85MM_NO_SILK  [1X01_SMD_3.25X0.85MM_NO_SILK]
JP382  M01PTH_SMD_3.25X0.85MM_NO_SILK  [1X01_SMD_3.25X0.85MM_NO_SILK]
JP383  M01PTH_SMD_3.25X0.85MM_NO_SILK  [1X01_SMD_3.25X0.85MM_NO_SILK]
JP384  M01PTH_SMD_3.25X0.85MM_NO_SILK  [1X01_SMD_3.25X0.85MM_NO_SILK]
JP385  M01PTH_SMD_3.25X0.85MM_NO_SILK  [1X01_SMD_3.25X0.85MM_NO_SILK]
JP386  M01PTH_SMD_3.25X0.85MM_NO_SILK  [1X01_SMD_3.25X0.85MM_NO_SILK]
JP387  M01PTH_SMD_3.25X0.85MM_NO_SILK  [1X01_SMD_3.25X0.85MM_NO_SILK]
JP388  M01PTH_SMD_3.25X0.85MM_NO_SILK  [1X01_SMD_3.25X0.85MM_NO_SILK]
JP389  M01PTH_SMD_3.25X0.85MM_NO_SILK  [1X01_SMD_3.25X0.85MM_NO_SILK]
JP390  M01PTH_SMD_3.25X0.85MM_NO_SILK  [1X01_SMD_3.25X0.85MM_NO_SILK]
JP391  M01PTH_SMD_3.25X0.85MM_NO_SILK  [1X01_SMD_3.25X0.85MM_NO_SILK]
JP392  M01PTH_SMD_3.25X0.85MM_NO_SILK  [1X01_SMD_3.25X0.85MM_NO_SILK]
JP393  M01PTH_SMD_3.25X0.85MM_NO_SILK  [1X01_SMD_3.25X0.85MM_NO_SILK]
JP394  M01PTH_SMD_3.25X0.85MM_NO_SILK  [1X01_SMD_3.25X0.85MM_NO_SILK]
JP395  M01PTH_SMD_3.25X0.85MM_NO_SILK  [1X01_SMD_3.25X0.85MM_NO_SILK]
JP396  M01PTH_SMD_3.25X0.85MM_NO_SILK  [1X01_SMD_3.25X0.85MM_NO_SILK]
JP397  M01PTH_SMD_3.25X0.85MM_NO_SILK  [1X01_SMD_3.25X0.85MM_NO_SILK]
JP398  M01PTH_SMD_3.25X0.85MM_NO_SILK  [1X01_SMD_3.25X0.85MM_NO_SILK]
JP399  M01PTH_SMD_3.25X0.85MM_NO_SILK  [1X01_SMD_3.25X0.85MM_NO_SILK]
JP400  M01PTH_SMD_3.25X0.85MM_NO_SILK  [1X01_SMD_3.25X0.85MM_NO_SILK]
JP401  M01PTH_SMD_3.25X0.85MM_NO_SILK  [1X01_SMD_3.25X0.85MM_NO_SILK]
JP402  M01PTH_SMD_3.25X0.85MM_NO_SILK  [1X01_SMD_3.25X0.85MM_NO_SILK]
JP403  M01PTH_SMD_3.25X0.85MM_NO_SILK  [1X01_SMD_3.25X0.85MM_NO_SILK]
JP404  M01PTH_SMD_3.25X0.85MM_NO_SILK  [1X01_SMD_3.25X0.85MM_NO_SILK]
JP405  M01PTH_SMD_3.25X0.85MM_NO_SILK  [1X01_SMD_3.25X0.85MM_NO_SILK]
JP406  M01PTH_SMD_3.25X0.85MM_NO_SILK  [1X01_SMD_3.25X0.85MM_NO_SILK]
JP407  M01PTH_SMD_3.25X0.85MM_NO_SILK  [1X01_SMD_3.25X0.85MM_NO_SILK]
JP408  M01PTH_SMD_3.25X0.85MM_NO_SILK  [1X01_SMD_3.25X0.85MM_NO_SILK]
JP409  M01PTH_SMD_3.25X0.85MM_NO_SILK  [1X01_SMD_3.25X0.85MM_NO_SILK]
JP410  M01PTH_SMD_3.25X0.85MM_NO_SILK  [1X01_SMD_3.25X0.85MM_NO_SILK]
JP411  M01PTH_SMD_3.25X0.85MM_NO_SILK  [1X01_SMD_3.25X0.85MM_NO_SILK]
JP412  M01PTH_SMD_3.25X0.85MM_NO_SILK  [1X01_SMD_3.25X0.85MM_NO_SILK]
JP413  M01PTH_SMD_3.25X0.85MM_NO_SILK  [1X01_SMD_3.25X0.85MM_NO_SILK]
JP414  M01PTH_SMD_3.25X0.85MM_NO_SILK  [1X01_SMD_3.25X0.85MM_NO_SILK]
JP415  M01PTH_SMD_3.25X0.85MM_NO_SILK  [1X01_SMD_3.25X0.85MM_NO_SILK]
JP416  M01PTH_SMD_3.25X0.85MM_NO_SILK  [1X01_SMD_3.25X0.85MM_NO_SILK]
JP417  M01PTH_SMD_3.25X0.85MM_NO_SILK  [1X01_SMD_3.25X0.85MM_NO_SILK]
JP418  M01PTH_SMD_3.25X0.85MM_NO_SILK  [1X01_SMD_3.25X0.85MM_NO_SILK]
JP419  M01PTH_SMD_3.25X0.85MM_NO_SILK  [1X01_SMD_3.25X0.85MM_NO_SILK]
JP420  M01PTH_SMD_3.25X0.85MM_NO_SILK  [1X01_SMD_3.25X0.85MM_NO_SILK]
JP421  M01PTH_SMD_3.25X0.85MM_NO_SILK  [1X01_SMD_3.25X0.85MM_NO_SILK]
JP422  M01PTH_SMD_3.25X0.85MM_NO_SILK  [1X01_SMD_3.25X0.85MM_NO_SILK]
JP423  M01PTH_SMD_3.25X0.85MM_NO_SILK  [1X01_SMD_3.25X0.85MM_NO_SILK]
JP424  M01PTH_SMD_3.25X0.85MM_NO_SILK  [1X01_SMD_3.25X0.85MM_NO_SILK]
JP425  M01PTH_SMD_3.25X0.85MM_NO_SILK  [1X01_SMD_3.25X0.85MM_NO_SILK]
JP426  M01PTH_SMD_3.25X0.85MM_NO_SILK  [1X01_SMD_3.25X0.85MM_NO_SILK]
JP427  M01PTH_SMD_3.25X0.85MM_NO_SILK  [1X01_SMD_3.25X0.85MM_NO_SILK]
JP428  M01PTH_SMD_3.25X0.85MM_NO_SILK  [1X01_SMD_3.25X0.85MM_NO_SILK]
JP429  M01PTH_SMD_3.25X0.85MM_NO_SILK  [1X01_SMD_3.25X0.85MM_NO_SILK]
JP430  M01PTH_SMD_3.25X0.85MM_NO_SILK  [1X01_SMD_3.25X0.85MM_NO_SILK]
JP431  M01PTH_SMD_3.25X0.85MM_NO_SILK  [1X01_SMD_3.25X0.85MM_NO_SILK]
JP432  M01PTH_SMD_3.25X0.85MM_NO_SILK  [1X01_SMD_3.25X0.85MM_NO_SILK]
JP433  M01PTH_SMD_3.25X0.85MM_NO_SILK  [1X01_SMD_3.25X0.85MM_NO_SILK]
JP434  M01PTH_SMD_3.25X0.85MM_NO_SILK  [1X01_SMD_3.25X0.85MM_NO_SILK]
JP435  M01PTH_SMD_3.25X0.85MM_NO_SILK  [1X01_SMD_3.25X0.85MM_NO_SILK]
JP436  M01PTH_SMD_3.25X0.85MM_NO_SILK  [1X01_SMD_3.25X0.85MM_NO_SILK]
JP437  M01PTH_SMD_3.25X0.85MM_NO_SILK  [1X01_SMD_3.25X0.85MM_NO_SILK]
JP438  M01PTH_SMD_3.25X0.85MM_NO_SILK  [1X01_SMD_3.25X0.85MM_NO_SILK]
JP439  M01PTH_SMD_3.25X0.85MM_NO_SILK  [1X01_SMD_3.25X0.85MM_NO_SILK]
JP440  M01PTH_SMD_3.25X0.85MM_NO_SILK  [1X01_SMD_3.25X0.85MM_NO_SILK]
JP441  M01PTH_SMD_3.25X0.85MM_NO_SILK  [1X01_SMD_3.25X0.85MM_NO_SILK]
JP442  M01PTH_SMD_3.25X0.85MM_NO_SILK  [1X01_SMD_3.25X0.85MM_NO_SILK]
JP443  M01PTH_SMD_3.25X0.85MM_NO_SILK  [1X01_SMD_3.25X0.85MM_NO_SILK]
JP444  M01PTH_SMD_3.25X0.85MM_NO_SILK  [1X01_SMD_3.25X0.85MM_NO_SILK]
JP445  M01PTH_SMD_3.25X0.85MM_NO_SILK  [1X01_SMD_3.25X0.85MM_NO_SILK]
JP446  M01PTH_SMD_3.25X0.85MM_NO_SILK  [1X01_SMD_3.25X0.85MM_NO_SILK]
JP447  M01PTH_SMD_3.25X0.85MM_NO_SILK  [1X01_SMD_3.25X0.85MM_NO_SILK]
JP448  M01PTH_SMD_3.25X0.85MM_NO_SILK  [1X01_SMD_3.25X0.85MM_NO_SILK]
JP449  M01PTH_SMD_3.25X0.85MM_NO_SILK  [1X01_SMD_3.25X0.85MM_NO_SILK]
JP450  M01PTH_SMD_3.25X0.85MM_NO_SILK  [1X01_SMD_3.25X0.85MM_NO_SILK]
JP451  M01PTH_SMD_3.25X0.85MM_NO_SILK  [1X01_SMD_3.25X0.85MM_NO_SILK]
JP452  M01PTH_SMD_3.25X0.85MM_NO_SILK  [1X01_SMD_3.25X0.85MM_NO_SILK]
JP453  M01PTH_SMD_3.25X0.85MM_NO_SILK  [1X01_SMD_3.25X0.85MM_NO_SILK]
JP454  M01PTH_SMD_3.25X0.85MM_NO_SILK  [1X01_SMD_3.25X0.85MM_NO_SILK]
JP455  M01PTH_SMD_3.25X0.85MM_NO_SILK  [1X01_SMD_3.25X0.85MM_NO_SILK]
JP456  M01PTH_SMD_3.25X0.85MM_NO_SILK  [1X01_SMD_3.25X0.85MM_NO_SILK]
JP457  M01PTH_SMD_3.25X0.85MM_NO_SILK  [1X01_SMD_3.25X0.85MM_NO_SILK]
JP458  M01PTH_SMD_3.25X0.85MM_NO_SILK  [1X01_SMD_3.25X0.85MM_NO_SILK]
JP459  M01PTH_SMD_3.25X0.85MM_NO_SILK  [1X01_SMD_3.25X0.85MM_NO_SILK]
JP460  M01PTH_SMD_3.25X0.85MM_NO_SILK  [1X01_SMD_3.25X0.85MM_NO_SILK]
JP461  M01PTH_SMD_3.25X0.85MM_NO_SILK  [1X01_SMD_3.25X0.85MM_NO_SILK]
JP462  M01PTH_SMD_3.25X0.85MM_NO_SILK  [1X01_SMD_3.25X0.85MM_NO_SILK]
JP463  M01PTH_SMD_3.25X0.85MM_NO_SILK  [1X01_SMD_3.25X0.85MM_NO_SILK]
JP464  M01PTH_SMD_3.25X0.85MM_NO_SILK  [1X01_SMD_3.25X0.85MM_NO_SILK]
JP465  M01PTH_SMD_3.25X0.85MM_NO_SILK  [1X01_SMD_3.25X0.85MM_NO_SILK]
JP466  M01PTH_SMD_3.25X0.85MM_NO_SILK  [1X01_SMD_3.25X0.85MM_NO_SILK]
JP467  M01PTH_SMD_3.25X0.85MM_NO_SILK  [1X01_SMD_3.25X0.85MM_NO_SILK]
JP468  M01PTH_SMD_3.25X0.85MM_NO_SILK  [1X01_SMD_3.25X0.85MM_NO_SILK]
JP469  M01PTH_SMD_3.25X0.85MM_NO_SILK  [1X01_SMD_3.25X0.85MM_NO_SILK]
JP470  M01PTH_SMD_3.25X0.85MM_NO_SILK  [1X01_SMD_3.25X0.85MM_NO_SILK]
JP471  M01PTH_SMD_3.25X0.85MM_NO_SILK  [1X01_SMD_3.25X0.85MM_NO_SILK]
JP472  M01PTH_SMD_3.25X0.85MM_NO_SILK  [1X01_SMD_3.25X0.85MM_NO_SILK]
JP473  M01PTH_SMD_3.25X0.85MM_NO_SILK  [1X01_SMD_3.25X0.85MM_NO_SILK]
JP474  M01PTH_SMD_3.25X0.85MM_NO_SILK  [1X01_SMD_3.25X0.85MM_NO_SILK]
JP475  M01PTH_SMD_3.25X0.85MM_NO_SILK  [1X01_SMD_3.25X0.85MM_NO_SILK]
JP476  M01PTH_SMD_3.25X0.85MM_NO_SILK  [1X01_SMD_3.25X0.85MM_NO_SILK]
JP477  M01PTH_SMD_3.25X0.85MM_NO_SILK  [1X01_SMD_3.25X0.85MM_NO_SILK]
JP478  M01PTH_SMD_3.25X0.85MM_NO_SILK  [1X01_SMD_3.25X0.85MM_NO_SILK]
JP479  M01PTH_SMD_3.25X0.85MM_NO_SILK  [1X01_SMD_3.25X0.85MM_NO_SILK]
JP480  M01PTH_SMD_3.25X0.85MM_NO_SILK  [1X01_SMD_3.25X0.85MM_NO_SILK]
JP481  M01PTH_SMD_3.25X0.85MM_NO_SILK  [1X01_SMD_3.25X0.85MM_NO_SILK]
JP482  M01PTH_SMD_3.25X0.85MM_NO_SILK  [1X01_SMD_3.25X0.85MM_NO_SILK]
JP483  M01PTH_SMD_3.25X0.85MM_NO_SILK  [1X01_SMD_3.25X0.85MM_NO_SILK]
JP484  M01PTH_SMD_3.25X0.85MM_NO_SILK  [1X01_SMD_3.25X0.85MM_NO_SILK]
JP485  M01PTH_SMD_3.25X0.85MM_NO_SILK  [1X01_SMD_3.25X0.85MM_NO_SILK]
JP486  M01PTH_SMD_3.25X0.85MM_NO_SILK  [1X01_SMD_3.25X0.85MM_NO_SILK]
JP487  M01PTH_SMD_3.25X0.85MM_NO_SILK  [1X01_SMD_3.25X0.85MM_NO_SILK]
JP488  M01PTH_SMD_3.25X0.85MM_NO_SILK  [1X01_SMD_3.25X0.85MM_NO_SILK]
JP489  M01PTH_SMD_3.25X0.85MM_NO_SILK  [1X01_SMD_3.25X0.85MM_NO_SILK]
JP490  M01PTH_SMD_3.25X0.85MM_NO_SILK  [1X01_SMD_3.25X0.85MM_NO_SILK]
JP491  M01PTH_SMD_3.25X0.85MM_NO_SILK  [1X01_SMD_3.25X0.85MM_NO_SILK]
JP492  M01PTH_SMD_3.25X0.85MM_NO_SILK  [1X01_SMD_3.25X0.85MM_NO_SILK]
JP493  M01PTH_SMD_3.25X0.85MM_NO_SILK  [1X01_SMD_3.25X0.85MM_NO_SILK]
JP494  M01PTH_SMD_3.25X0.85MM_NO_SILK  [1X01_SMD_3.25X0.85MM_NO_SILK]
JP495  M01PTH_SMD_3.25X0.85MM_NO_SILK  [1X01_SMD_3.25X0.85MM_NO_SILK]
JP496  M01PTH_SMD_3.25X0.85MM_NO_SILK  [1X01_SMD_3.25X0.85MM_NO_SILK]
JP497  M01PTH_SMD_3.25X0.85MM_NO_SILK  [1X01_SMD_3.25X0.85MM_NO_SILK]
JP498  M01PTH_SMD_3.25X0.85MM_NO_SILK  [1X01_SMD_3.25X0.85MM_NO_SILK]
JP499  M01PTH_SMD_3.25X0.85MM_NO_SILK  [1X01_SMD_3.25X0.85MM_NO_SILK]
JP500  M01PTH_SMD_3.25X0.85MM_NO_SILK  [1X01_SMD_3.25X0.85MM_NO_SILK]
JP501  M01PTH_SMD_3.25X0.85MM_NO_SILK  [1X01_SMD_3.25X0.85MM_NO_SILK]
JP502  M01PTH_SMD_3.25X0.85MM_NO_SILK  [1X01_SMD_3.25X0.85MM_NO_SILK]
JP503  M01PTH_SMD_3.25X0.85MM_NO_SILK  [1X01_SMD_3.25X0.85MM_NO_SILK]
JP504  M01PTH_SMD_3.25X0.85MM_NO_SILK  [1X01_SMD_3.25X0.85MM_NO_SILK]
JP505  M01PTH_SMD_3.25X0.85MM_NO_SILK  [1X01_SMD_3.25X0.85MM_NO_SILK]
JP506  M01PTH_SMD_3.25X0.85MM_NO_SILK  [1X01_SMD_3.25X0.85MM_NO_SILK]
JP507  M01PTH_SMD_3.25X0.85MM_NO_SILK  [1X01_SMD_3.25X0.85MM_NO_SILK]
JP508  M01PTH_SMD_3.25X0.85MM_NO_SILK  [1X01_SMD_3.25X0.85MM_NO_SILK]
JP509  M01PTH_SMD_3.25X0.85MM_NO_SILK  [1X01_SMD_3.25X0.85MM_NO_SILK]
JP510  M01PTH_SMD_3.25X0.85MM_NO_SILK  [1X01_SMD_3.25X0.85MM_NO_SILK]
JP511  M01PTH_SMD_3.25X0.85MM_NO_SILK  [1X01_SMD_3.25X0.85MM_NO_SILK]
JP512  M01PTH_SMD_3.25X0.85MM_NO_SILK  [1X01_SMD_3.25X0.85MM_NO_SILK]
JP513  M01PTH_SMD_3.25X0.85MM_NO_SILK  [1X01_SMD_3.25X0.85MM_NO_SILK]
JP514  M01PTH_SMD_3.25X0.85MM_NO_SILK  [1X01_SMD_3.25X0.85MM_NO_SILK]
JP515  M01PTH_SMD_3.25X0.85MM_NO_SILK  [1X01_SMD_3.25X0.85MM_NO_SILK]
JP516  M01PTH_SMD_3.25X0.85MM_NO_SILK  [1X01_SMD_3.25X0.85MM_NO_SILK]
JP517  M01PTH_SMD_3.25X0.85MM_NO_SILK  [1X01_SMD_3.25X0.85MM_NO_SILK]
JP518  M01PTH_SMD_3.25X0.85MM_NO_SILK  [1X01_SMD_3.25X0.85MM_NO_SILK]
JP519  M01PTH_SMD_3.25X0.85MM_NO_SILK  [1X01_SMD_3.25X0.85MM_NO_SILK]
JP520  M01PTH_SMD_3.25X0.85MM_NO_SILK  [1X01_SMD_3.25X0.85MM_NO_SILK]
JP521  M01PTH_SMD_3.25X0.85MM_NO_SILK  [1X01_SMD_3.25X0.85MM_NO_SILK]
JP522  M01PTH_SMD_3.25X0.85MM_NO_SILK  [1X01_SMD_3.25X0.85MM_NO_SILK]
JP523  M01PTH_SMD_3.25X0.85MM_NO_SILK  [1X01_SMD_3.25X0.85MM_NO_SILK]
JP524  M01PTH_SMD_3.25X0.85MM_NO_SILK  [1X01_SMD_3.25X0.85MM_NO_SILK]
JP525  M01PTH_SMD_3.25X0.85MM_NO_SILK  [1X01_SMD_3.25X0.85MM_NO_SILK]
JP526  M01PTH_SMD_3.25X0.85MM_NO_SILK  [1X01_SMD_3.25X0.85MM_NO_SILK]
JP527  M01PTH_SMD_3.25X0.85MM_NO_SILK  [1X01_SMD_3.25X0.85MM_NO_SILK]
JP528  M01PTH_SMD_3.25X0.85MM_NO_SILK  [1X01_SMD_3.25X0.85MM_NO_SILK]
JP529  M01PTH_SMD_3.25X0.85MM_NO_SILK  [1X01_SMD_3.25X0.85MM_NO_SILK]
JP530  M01PTH_SMD_3.25X0.85MM_NO_SILK  [1X01_SMD_3.25X0.85MM_NO_SILK]
JP531  M01PTH_SMD_3.25X0.85MM_NO_SILK  [1X01_SMD_3.25X0.85MM_NO_SILK]
JP532  M01PTH_SMD_3.25X0.85MM_NO_SILK  [1X01_SMD_3.25X0.85MM_NO_SILK]
JP533  M01PTH_SMD_3.25X0.85MM_NO_SILK  [1X01_SMD_3.25X0.85MM_NO_SILK]
JP534  M01PTH_SMD_3.25X0.85MM_NO_SILK  [1X01_SMD_3.25X0.85MM_NO_SILK]
JP535  M01PTH_SMD_3.25X0.85MM_NO_SILK  [1X01_SMD_3.25X0.85MM_NO_SILK]
JP536  M01PTH_SMD_3.25X0.85MM_NO_SILK  [1X01_SMD_3.25X0.85MM_NO_SILK]
JP537  M01PTH_SMD_3.25X0.85MM_NO_SILK  [1X01_SMD_3.25X0.85MM_NO_SILK]
JP538  M01PTH_SMD_3.25X0.85MM_NO_SILK  [1X01_SMD_3.25X0.85MM_NO_SILK]
JP539  M01PTH_SMD_3.25X0.85MM_NO_SILK  [1X01_SMD_3.25X0.85MM_NO_SILK]
JP540  M01PTH_SMD_3.25X0.85MM_NO_SILK  [1X01_SMD_3.25X0.85MM_NO_SILK]
JP541  M01PTH_SMD_3.25X0.85MM_NO_SILK  [1X01_SMD_3.25X0.85MM_NO_SILK]
JP542  M01PTH_SMD_3.25X0.85MM_NO_SILK  [1X01_SMD_3.25X0.85MM_NO_SILK]
JP543  M01PTH_SMD_3.25X0.85MM_NO_SILK  [1X01_SMD_3.25X0.85MM_NO_SILK]
JP544  M01PTH_SMD_3.25X0.85MM_NO_SILK  [1X01_SMD_3.25X0.85MM_NO_SILK]
JP545  M01PTH_SMD_3.25X0.85MM_NO_SILK  [1X01_SMD_3.25X0.85MM_NO_SILK]
JP546  M01PTH_SMD_3.25X0.85MM_NO_SILK  [1X01_SMD_3.25X0.85MM_NO_SILK]
JP547  M01PTH_SMD_3.25X0.85MM_NO_SILK  [1X01_SMD_3.25X0.85MM_NO_SILK]
JP548  M01PTH_SMD_3.25X0.85MM_NO_SILK  [1X01_SMD_3.25X0.85MM_NO_SILK]
JP549  M01PTH_SMD_3.25X0.85MM_NO_SILK  [1X01_SMD_3.25X0.85MM_NO_SILK]
JP550  M01PTH_SMD_3.25X0.85MM_NO_SILK  [1X01_SMD_3.25X0.85MM_NO_SILK]
JP551  M01PTH_SMD_3.25X0.85MM_NO_SILK  [1X01_SMD_3.25X0.85MM_NO_SILK]
JP552  M01PTH_SMD_3.25X0.85MM_NO_SILK  [1X01_SMD_3.25X0.85MM_NO_SILK]
JP553  M01PTH_SMD_3.25X0.85MM_NO_SILK  [1X01_SMD_3.25X0.85MM_NO_SILK]
JP554  M01PTH_SMD_3.25X0.85MM_NO_SILK  [1X01_SMD_3.25X0.85MM_NO_SILK]
JP555  M01PTH_SMD_3.25X0.85MM_NO_SILK  [1X01_SMD_3.25X0.85MM_NO_SILK]
JP556  M01PTH_SMD_3.25X0.85MM_NO_SILK  [1X01_SMD_3.25X0.85MM_NO_SILK]
JP557  M01PTH_SMD_3.25X0.85MM_NO_SILK  [1X01_SMD_3.25X0.85MM_NO_SILK]
JP558  M01PTH_SMD_3.25X0.85MM_NO_SILK  [1X01_SMD_3.25X0.85MM_NO_SILK]
JP559  M01PTH_SMD_3.25X0.85MM_NO_SILK  [1X01_SMD_3.25X0.85MM_NO_SILK]
JP560  M01PTH_SMD_3.25X0.85MM_NO_SILK  [1X01_SMD_3.25X0.85MM_NO_SILK]
JP561  M01PTH_SMD_3.25X0.85MM_NO_SILK  [1X01_SMD_3.25X0.85MM_NO_SILK]
JP562  M01PTH_SMD_3.25X0.85MM_NO_SILK  [1X01_SMD_3.25X0.85MM_NO_SILK]
JP563  M01PTH_SMD_3.25X0.85MM_NO_SILK  [1X01_SMD_3.25X0.85MM_NO_SILK]
JP564  M01PTH_SMD_3.25X0.85MM_NO_SILK  [1X01_SMD_3.25X0.85MM_NO_SILK]
JP565  M01PTH_SMD_3.25X0.85MM_NO_SILK  [1X01_SMD_3.25X0.85MM_NO_SILK]
JP566  M01PTH_SMD_3.25X0.85MM_NO_SILK  [1X01_SMD_3.25X0.85MM_NO_SILK]
JP567  M01PTH_SMD_3.25X0.85MM_NO_SILK  [1X01_SMD_3.25X0.85MM_NO_SILK]
JP568  M01PTH_SMD_3.25X0.85MM_NO_SILK  [1X01_SMD_3.25X0.85MM_NO_SILK]
JP569  M01PTH_SMD_3.25X0.85MM_NO_SILK  [1X01_SMD_3.25X0.85MM_NO_SILK]
JP570  M01PTH_SMD_3.25X0.85MM_NO_SILK  [1X01_SMD_3.25X0.85MM_NO_SILK]
JP571  M01PTH_SMD_3.25X0.85MM_NO_SILK  [1X01_SMD_3.25X0.85MM_NO_SILK]
JP572  M01PTH_SMD_3.25X0.85MM_NO_SILK  [1X01_SMD_3.25X0.85MM_NO_SILK]
JP573  M01PTH_SMD_3.25X0.85MM_NO_SILK  [1X01_SMD_3.25X0.85MM_NO_SILK]
JP574  M01PTH_SMD_3.25X0.85MM_NO_SILK  [1X01_SMD_3.25X0.85MM_NO_SILK]
JP575  M01PTH_SMD_3.25X0.85MM_NO_SILK  [1X01_SMD_3.25X0.85MM_NO_SILK]
JP576  M01PTH_SMD_3.25X0.85MM_NO_SILK  [1X01_SMD_3.25X0.85MM_NO_SILK]
JP577  M01PTH_SMD_3.25X0.85MM_NO_SILK  [1X01_SMD_3.25X0.85MM_NO_SILK]
JP578  M01PTH_SMD_3.25X0.85MM_NO_SILK  [1X01_SMD_3.25X0.85MM_NO_SILK]
JP579  M01PTH_SMD_3.25X0.85MM_NO_SILK  [1X01_SMD_3.25X0.85MM_NO_SILK]
JP580  M01PTH_SMD_3.25X0.85MM_NO_SILK  [1X01_SMD_3.25X0.85MM_NO_SILK]
JP581  M01PTH_SMD_3.25X0.85MM_NO_SILK  [1X01_SMD_3.25X0.85MM_NO_SILK]
JP582  M01PTH_SMD_3.25X0.85MM_NO_SILK  [1X01_SMD_3.25X0.85MM_NO_SILK]
JP583  M01PTH_SMD_3.25X0.85MM_NO_SILK  [1X01_SMD_3.25X0.85MM_NO_SILK]
JP584  M01PTH_SMD_3.25X0.85MM_NO_SILK  [1X01_SMD_3.25X0.85MM_NO_SILK]
JP585  M01PTH_SMD_3.25X0.85MM_NO_SILK  [1X01_SMD_3.25X0.85MM_NO_SILK]
JP586  M01PTH_SMD_3.25X0.85MM_NO_SILK  [1X01_SMD_3.25X0.85MM_NO_SILK]
JP587  M01PTH_SMD_3.25X0.85MM_NO_SILK  [1X01_SMD_3.25X0.85MM_NO_SILK]
JP588  M01PTH_SMD_3.25X0.85MM_NO_SILK  [1X01_SMD_3.25X0.85MM_NO_SILK]
JP589  M01PTH_SMD_3.25X0.85MM_NO_SILK  [1X01_SMD_3.25X0.85MM_NO_SILK]
JP590  M01PTH_SMD_3.25X0.85MM_NO_SILK  [1X01_SMD_3.25X0.85MM_NO_SILK]
JP591  M01PTH_SMD_3.25X0.85MM_NO_SILK  [1X01_SMD_3.25X0.85MM_NO_SILK]
JP592  M01PTH_SMD_3.25X0.85MM_NO_SILK  [1X01_SMD_3.25X0.85MM_NO_SILK]
JP593  M01PTH_SMD_3.25X0.85MM_NO_SILK  [1X01_SMD_3.25X0.85MM_NO_SILK]
JP594  M01PTH_SMD_3.25X0.85MM_NO_SILK  [1X01_SMD_3.25X0.85MM_NO_SILK]
JP595  M01PTH_SMD_3.25X0.85MM_NO_SILK  [1X01_SMD_3.25X0.85MM_NO_SILK]
JP596  M01PTH_SMD_3.25X0.85MM_NO_SILK  [1X01_SMD_3.25X0.85MM_NO_SILK]
JP597  M01PTH_SMD_3.25X0.85MM_NO_SILK  [1X01_SMD_3.25X0.85MM_NO_SILK]
JP598  M01PTH_SMD_3.25X0.85MM_NO_SILK  [1X01_SMD_3.25X0.85MM_NO_SILK]
JP599  M01PTH_SMD_3.25X0.85MM_NO_SILK  [1X01_SMD_3.25X0.85MM_NO_SILK]
JP600  M01PTH_SMD_3.25X0.85MM_NO_SILK  [1X01_SMD_3.25X0.85MM_NO_SILK]
JP601  M01PTH_SMD_3.25X0.85MM_NO_SILK  [1X01_SMD_3.25X0.85MM_NO_SILK]
JP602  M01PTH_SMD_3.25X0.85MM_NO_SILK  [1X01_SMD_3.25X0.85MM_NO_SILK]
JP603  M01PTH_SMD_3.25X0.85MM_NO_SILK  [1X01_SMD_3.25X0.85MM_NO_SILK]
JP604  M01PTH_SMD_3.25X0.85MM_NO_SILK  [1X01_SMD_3.25X0.85MM_NO_SILK]
JP605  M01PTH_SMD_3.25X0.85MM_NO_SILK  [1X01_SMD_3.25X0.85MM_NO_SILK]
JP606  M01PTH_SMD_3.25X0.85MM_NO_SILK  [1X01_SMD_3.25X0.85MM_NO_SILK]
JP607  M01PTH_SMD_3.25X0.85MM_NO_SILK  [1X01_SMD_3.25X0.85MM_NO_SILK]
JP608  M01PTH_SMD_3.25X0.85MM_NO_SILK  [1X01_SMD_3.25X0.85MM_NO_SILK]
JP609  M01PTH_SMD_3.25X0.85MM_NO_SILK  [1X01_SMD_3.25X0.85MM_NO_SILK]
JP610  M01PTH_SMD_3.25X0.85MM_NO_SILK  [1X01_SMD_3.25X0.85MM_NO_SILK]
JP611  M01PTH_SMD_3.25X0.85MM_NO_SILK  [1X01_SMD_3.25X0.85MM_NO_SILK]
JP612  M01PTH_SMD_3.25X0.85MM_NO_SILK  [1X01_SMD_3.25X0.85MM_NO_SILK]
JP613  M01PTH_SMD_3.25X0.85MM_NO_SILK  [1X01_SMD_3.25X0.85MM_NO_SILK]
JP614  M01PTH_SMD_3.25X0.85MM_NO_SILK  [1X01_SMD_3.25X0.85MM_NO_SILK]
JP615  M01PTH_SMD_3.25X0.85MM_NO_SILK  [1X01_SMD_3.25X0.85MM_NO_SILK]
JP616  M01PTH_SMD_3.25X0.85MM_NO_SILK  [1X01_SMD_3.25X0.85MM_NO_SILK]
JP617  M01PTH_SMD_3.25X0.85MM_NO_SILK  [1X01_SMD_3.25X0.85MM_NO_SILK]
JP618  M01PTH_SMD_3.25X0.85MM_NO_SILK  [1X01_SMD_3.25X0.85MM_NO_SILK]
JP619  M01PTH_SMD_3.25X0.85MM_NO_SILK  [1X01_SMD_3.25X0.85MM_NO_SILK]
JP620  M01PTH_SMD_3.25X0.85MM_NO_SILK  [1X01_SMD_3.25X0.85MM_NO_SILK]
JP621  M01PTH_SMD_3.25X0.85MM_NO_SILK  [1X01_SMD_3.25X0.85MM_NO_SILK]
JP622  M01PTH_SMD_3.25X0.85MM_NO_SILK  [1X01_SMD_3.25X0.85MM_NO_SILK]
JP623  M01PTH_SMD_3.25X0.85MM_NO_SILK  [1X01_SMD_3.25X0.85MM_NO_SILK]
JP624  M01PTH_SMD_3.25X0.85MM_NO_SILK  [1X01_SMD_3.25X0.85MM_NO_SILK]
JP625  M01PTH_SMD_3.25X0.85MM_NO_SILK  [1X01_SMD_3.25X0.85MM_NO_SILK]
JP626  M01PTH_SMD_3.25X0.85MM_NO_SILK  [1X01_SMD_3.25X0.85MM_NO_SILK]
JP627  M01PTH_SMD_3.25X0.85MM_NO_SILK  [1X01_SMD_3.25X0.85MM_NO_SILK]
JP628  M01PTH_SMD_3.25X0.85MM_NO_SILK  [1X01_SMD_3.25X0.85MM_NO_SILK]
JP629  M01PTH_SMD_3.25X0.85MM_NO_SILK  [1X01_SMD_3.25X0.85MM_NO_SILK]
JP630  M01PTH_SMD_3.25X0.85MM_NO_SILK  [1X01_SMD_3.25X0.85MM_NO_SILK]
JP631  M01PTH_SMD_3.25X0.85MM_NO_SILK  [1X01_SMD_3.25X0.85MM_NO_SILK]
JP632  M01PTH_SMD_3.25X0.85MM_NO_SILK  [1X01_SMD_3.25X0.85MM_NO_SILK]
JP633  M01PTH_SMD_3.25X0.85MM_NO_SILK  [1X01_SMD_3.25X0.85MM_NO_SILK]
JP634  M01PTH_SMD_3.25X0.85MM_NO_SILK  [1X01_SMD_3.25X0.85MM_NO_SILK]
JP635  M01PTH_SMD_3.25X0.85MM_NO_SILK  [1X01_SMD_3.25X0.85MM_NO_SILK]
JP636  M01PTH_SMD_3.25X0.85MM_NO_SILK  [1X01_SMD_3.25X0.85MM_NO_SILK]
JP637  M01PTH_SMD_3.25X0.85MM_NO_SILK  [1X01_SMD_3.25X0.85MM_NO_SILK]
JP638  M01PTH_SMD_3.25X0.85MM_NO_SILK  [1X01_SMD_3.25X0.85MM_NO_SILK]
JP639  M01PTH_SMD_3.25X0.85MM_NO_SILK  [1X01_SMD_3.25X0.85MM_NO_SILK]
JP640  M01PTH_SMD_3.25X0.85MM_NO_SILK  [1X01_SMD_3.25X0.85MM_NO_SILK]
JP641  M01PTH_SMD_3.25X0.85MM_NO_SILK  [1X01_SMD_3.25X0.85MM_NO_SILK]
JP642  M01PTH_SMD_3.25X0.85MM_NO_SILK  [1X01_SMD_3.25X0.85MM_NO_SILK]
JP643  M01PTH_SMD_3.25X0.85MM_NO_SILK  [1X01_SMD_3.25X0.85MM_NO_SILK]
JP644  M01PTH_SMD_3.25X0.85MM_NO_SILK  [1X01_SMD_3.25X0.85MM_NO_SILK]
JP645  M01PTH_SMD_3.25X0.85MM_NO_SILK  [1X01_SMD_3.25X0.85MM_NO_SILK]
JP646  M01PTH_SMD_3.25X0.85MM_NO_SILK  [1X01_SMD_3.25X0.85MM_NO_SILK]
JP647  M01PTH_SMD_3.25X0.85MM_NO_SILK  [1X01_SMD_3.25X0.85MM_NO_SILK]
JP648  M01PTH_SMD_3.25X0.85MM_NO_SILK  [1X01_SMD_3.25X0.85MM_NO_SILK]
JP649  M01PTH_SMD_3.25X0.85MM_NO_SILK  [1X01_SMD_3.25X0.85MM_NO_SILK]
JP650  M01PTH_SMD_3.25X0.85MM_NO_SILK  [1X01_SMD_3.25X0.85MM_NO_SILK]
JP651  M01PTH_SMD_3.25X0.85MM_NO_SILK  [1X01_SMD_3.25X0.85MM_NO_SILK]
JP652  M01PTH_SMD_3.25X0.85MM_NO_SILK  [1X01_SMD_3.25X0.85MM_NO_SILK]
JP653  M01PTH_SMD_3.25X0.85MM_NO_SILK  [1X01_SMD_3.25X0.85MM_NO_SILK]
JP654  M01PTH_SMD_3.25X0.85MM_NO_SILK  [1X01_SMD_3.25X0.85MM_NO_SILK]
JP655  M01PTH_SMD_3.25X0.85MM_NO_SILK  [1X01_SMD_3.25X0.85MM_NO_SILK]
JP656  M01PTH_SMD_3.25X0.85MM_NO_SILK  [1X01_SMD_3.25X0.85MM_NO_SILK]
JP657  M01PTH_SMD_3.25X0.85MM_NO_SILK  [1X01_SMD_3.25X0.85MM_NO_SILK]
JP658  M01PTH_SMD_3.25X0.85MM_NO_SILK  [1X01_SMD_3.25X0.85MM_NO_SILK]
JP659  M01PTH_SMD_3.25X0.85MM_NO_SILK  [1X01_SMD_3.25X0.85MM_NO_SILK]
JP660  M01PTH_SMD_3.25X0.85MM_NO_SILK  [1X01_SMD_3.25X0.85MM_NO_SILK]
JP661  M01PTH_SMD_3.25X0.85MM_NO_SILK  [1X01_SMD_3.25X0.85MM_NO_SILK]
JP662  M01PTH_SMD_3.25X0.85MM_NO_SILK  [1X01_SMD_3.25X0.85MM_NO_SILK]
JP663  M01PTH_SMD_3.25X0.85MM_NO_SILK  [1X01_SMD_3.25X0.85MM_NO_SILK]
JP664  M01PTH_SMD_3.25X0.85MM_NO_SILK  [1X01_SMD_3.25X0.85MM_NO_SILK]
JP665  M01PTH_SMD_3.25X0.85MM_NO_SILK  [1X01_SMD_3.25X0.85MM_NO_SILK]
JP666  M01PTH_SMD_3.25X0.85MM_NO_SILK  [1X01_SMD_3.25X0.85MM_NO_SILK]
JP667  M01PTH_SMD_3.25X0.85MM_NO_SILK  [1X01_SMD_3.25X0.85MM_NO_SILK]
JP668  M01PTH_SMD_3.25X0.85MM_NO_SILK  [1X01_SMD_3.25X0.85MM_NO_SILK]
JP669  M01PTH_SMD_3.25X0.85MM_NO_SILK  [1X01_SMD_3.25X0.85MM_NO_SILK]
JP670  M01PTH_SMD_3.25X0.85MM_NO_SILK  [1X01_SMD_3.25X0.85MM_NO_SILK]
JP671  M01PTH_SMD_3.25X0.85MM_NO_SILK  [1X01_SMD_3.25X0.85MM_NO_SILK]
JP672  M01PTH_SMD_3.25X0.85MM_NO_SILK  [1X01_SMD_3.25X0.85MM_NO_SILK]
JP673  M01PTH_SMD_3.25X0.85MM_NO_SILK  [1X01_SMD_3.25X0.85MM_NO_SILK]
JP674  M01PTH_SMD_3.25X0.85MM_NO_SILK  [1X01_SMD_3.25X0.85MM_NO_SILK]
JP675  M01PTH_SMD_3.25X0.85MM_NO_SILK  [1X01_SMD_3.25X0.85MM_NO_SILK]
JP676  M01PTH_SMD_3.25X0.85MM_NO_SILK  [1X01_SMD_3.25X0.85MM_NO_SILK]
JP677  M01PTH_SMD_3.25X0.85MM_NO_SILK  [1X01_SMD_3.25X0.85MM_NO_SILK]
JP678  M01PTH_SMD_3.25X0.85MM_NO_SILK  [1X01_SMD_3.25X0.85MM_NO_SILK]
JP679  M01PTH_SMD_3.25X0.85MM_NO_SILK  [1X01_SMD_3.25X0.85MM_NO_SILK]
JP680  M01PTH_SMD_3.25X0.85MM_NO_SILK  [1X01_SMD_3.25X0.85MM_NO_SILK]
JP681  M01PTH_SMD_3.25X0.85MM_NO_SILK  [1X01_SMD_3.25X0.85MM_NO_SILK]
JP682  M01PTH_SMD_3.25X0.85MM_NO_SILK  [1X01_SMD_3.25X0.85MM_NO_SILK]
JP683  M01PTH_SMD_3.25X0.85MM_NO_SILK  [1X01_SMD_3.25X0.85MM_NO_SILK]
JP684  M01PTH_SMD_3.25X0.85MM_NO_SILK  [1X01_SMD_3.25X0.85MM_NO_SILK]
JP685  M01PTH_SMD_3.25X0.85MM_NO_SILK  [1X01_SMD_3.25X0.85MM_NO_SILK]
JP686  M01PTH_SMD_3.25X0.85MM_NO_SILK  [1X01_SMD_3.25X0.85MM_NO_SILK]
JP687  M01PTH_SMD_3.25X0.85MM_NO_SILK  [1X01_SMD_3.25X0.85MM_NO_SILK]
JP688  M01PTH_SMD_3.25X0.85MM_NO_SILK  [1X01_SMD_3.25X0.85MM_NO_SILK]
JP689  M01PTH_SMD_3.25X0.85MM_NO_SILK  [1X01_SMD_3.25X0.85MM_NO_SILK]
JP690  M01PTH_SMD_3.25X0.85MM_NO_SILK  [1X01_SMD_3.25X0.85MM_NO_SILK]
JP691  M01PTH_SMD_3.25X0.85MM_NO_SILK  [1X01_SMD_3.25X0.85MM_NO_SILK]
JP692  M01PTH_SMD_3.25X0.85MM_NO_SILK  [1X01_SMD_3.25X0.85MM_NO_SILK]
JP693  M01PTH_SMD_3.25X0.85MM_NO_SILK  [1X01_SMD_3.25X0.85MM_NO_SILK]
JP694  M01PTH_SMD_3.25X0.85MM_NO_SILK  [1X01_SMD_3.25X0.85MM_NO_SILK]
JP695  M01PTH_SMD_3.25X0.85MM_NO_SILK  [1X01_SMD_3.25X0.85MM_NO_SILK]
JP696  M01PTH_SMD_3.25X0.85MM_NO_SILK  [1X01_SMD_3.25X0.85MM_NO_SILK]
JP697  M01PTH_SMD_3.25X0.85MM_NO_SILK  [1X01_SMD_3.25X0.85MM_NO_SILK]
JP698  M01PTH_SMD_3.25X0.85MM_NO_SILK  [1X01_SMD_3.25X0.85MM_NO_SILK]
JP699  M01PTH_SMD_3.25X0.85MM_NO_SILK  [1X01_SMD_3.25X0.85MM_NO_SILK]
JP700  M01PTH_SMD_3.25X0.85MM_NO_SILK  [1X01_SMD_3.25X0.85MM_NO_SILK]
JP701  M01PTH_SMD_3.25X0.85MM_NO_SILK  [1X01_SMD_3.25X0.85MM_NO_SILK]
JP702  M01PTH_SMD_3.25X0.85MM_NO_SILK  [1X01_SMD_3.25X0.85MM_NO_SILK]
JP703  M01PTH_SMD_3.25X0.85MM_NO_SILK  [1X01_SMD_3.25X0.85MM_NO_SILK]
JP704  M01PTH_SMD_3.25X0.85MM_NO_SILK  [1X01_SMD_3.25X0.85MM_NO_SILK]
JP705  M01PTH_SMD_3.25X0.85MM_NO_SILK  [1X01_SMD_3.25X0.85MM_NO_SILK]
JP706  M01PTH_SMD_3.25X0.85MM_NO_SILK  [1X01_SMD_3.25X0.85MM_NO_SILK]
JP707  M01PTH_SMD_3.25X0.85MM_NO_SILK  [1X01_SMD_3.25X0.85MM_NO_SILK]
JP708  M01PTH_SMD_3.25X0.85MM_NO_SILK  [1X01_SMD_3.25X0.85MM_NO_SILK]
JP709  M01PTH_SMD_3.25X0.85MM_NO_SILK  [1X01_SMD_3.25X0.85MM_NO_SILK]
JP710  M01PTH_SMD_3.25X0.85MM_NO_SILK  [1X01_SMD_3.25X0.85MM_NO_SILK]
JP711  M01PTH_SMD_3.25X0.85MM_NO_SILK  [1X01_SMD_3.25X0.85MM_NO_SILK]
JP712  M01PTH_SMD_3.25X0.85MM_NO_SILK  [1X01_SMD_3.25X0.85MM_NO_SILK]
JP713  M01PTH_SMD_3.25X0.85MM_NO_SILK  [1X01_SMD_3.25X0.85MM_NO_SILK]
JP714  M01PTH_SMD_3.25X0.85MM_NO_SILK  [1X01_SMD_3.25X0.85MM_NO_SILK]
JP715  M01PTH_SMD_3.25X0.85MM_NO_SILK  [1X01_SMD_3.25X0.85MM_NO_SILK]
JP716  M01PTH_SMD_3.25X0.85MM_NO_SILK  [1X01_SMD_3.25X0.85MM_NO_SILK]
JP717  M01PTH_SMD_3.25X0.85MM_NO_SILK  [1X01_SMD_3.25X0.85MM_NO_SILK]
JP718  M01PTH_SMD_3.25X0.85MM_NO_SILK  [1X01_SMD_3.25X0.85MM_NO_SILK]
JP719  M01PTH_SMD_3.25X0.85MM_NO_SILK  [1X01_SMD_3.25X0.85MM_NO_SILK]
JP720  M01PTH_SMD_3.25X0.85MM_NO_SILK  [1X01_SMD_3.25X0.85MM_NO_SILK]
JP721  M01PTH_SMD_3.25X0.85MM_NO_SILK  [1X01_SMD_3.25X0.85MM_NO_SILK]
JP722  M01PTH_SMD_3.25X0.85MM_NO_SILK  [1X01_SMD_3.25X0.85MM_NO_SILK]
JP723  M01PTH_SMD_3.25X0.85MM_NO_SILK  [1X01_SMD_3.25X0.85MM_NO_SILK]
JP724  M01PTH_SMD_3.25X0.85MM_NO_SILK  [1X01_SMD_3.25X0.85MM_NO_SILK]
JP725  M01PTH_SMD_3.25X0.85MM_NO_SILK  [1X01_SMD_3.25X0.85MM_NO_SILK]
JP726  M01PTH_SMD_3.25X0.85MM_NO_SILK  [1X01_SMD_3.25X0.85MM_NO_SILK]
JP727  M01PTH_SMD_3.25X0.85MM_NO_SILK  [1X01_SMD_3.25X0.85MM_NO_SILK]
JP728  M01PTH_SMD_3.25X0.85MM_NO_SILK  [1X01_SMD_3.25X0.85MM_NO_SILK]
JP729  M01PTH_SMD_3.25X0.85MM_NO_SILK  [1X01_SMD_3.25X0.85MM_NO_SILK]
JP730  M01PTH_SMD_3.25X0.85MM_NO_SILK  [1X01_SMD_3.25X0.85MM_NO_SILK]
JP731  M01PTH_SMD_3.25X0.85MM_NO_SILK  [1X01_SMD_3.25X0.85MM_NO_SILK]
JP732  M01PTH_SMD_3.25X0.85MM_NO_SILK  [1X01_SMD_3.25X0.85MM_NO_SILK]
JP733  M01PTH_SMD_3.25X0.85MM_NO_SILK  [1X01_SMD_3.25X0.85MM_NO_SILK]
JP734  M01PTH_SMD_3.25X0.85MM_NO_SILK  [1X01_SMD_3.25X0.85MM_NO_SILK]
JP735  M01PTH_SMD_3.25X0.85MM_NO_SILK  [1X01_SMD_3.25X0.85MM_NO_SILK]
JP736  M01PTH_SMD_3.25X0.85MM_NO_SILK  [1X01_SMD_3.25X0.85MM_NO_SILK]
JP737  M01PTH_SMD_3.25X0.85MM_NO_SILK  [1X01_SMD_3.25X0.85MM_NO_SILK]
JP738  M01PTH_SMD_3.25X0.85MM_NO_SILK  [1X01_SMD_3.25X0.85MM_NO_SILK]
JP739  M01PTH_SMD_3.25X0.85MM_NO_SILK  [1X01_SMD_3.25X0.85MM_NO_SILK]
JP740  M01PTH_SMD_3.25X0.85MM_NO_SILK  [1X01_SMD_3.25X0.85MM_NO_SILK]
JP741  M01PTH_SMD_3.25X0.85MM_NO_SILK  [1X01_SMD_3.25X0.85MM_NO_SILK]
JP742  M01PTH_SMD_3.25X0.85MM_NO_SILK  [1X01_SMD_3.25X0.85MM_NO_SILK]
JP743  M01PTH_SMD_3.25X0.85MM_NO_SILK  [1X01_SMD_3.25X0.85MM_NO_SILK]
JP744  M01PTH_SMD_3.25X0.85MM_NO_SILK  [1X01_SMD_3.25X0.85MM_NO_SILK]
JP745  M01PTH_SMD_3.25X0.85MM_NO_SILK  [1X01_SMD_3.25X0.85MM_NO_SILK]
JP746  M01PTH_SMD_3.25X0.85MM_NO_SILK  [1X01_SMD_3.25X0.85MM_NO_SILK]
JP747  M01PTH_SMD_3.25X0.85MM_NO_SILK  [1X01_SMD_3.25X0.85MM_NO_SILK]
JP748  M01PTH_SMD_3.25X0.85MM_NO_SILK  [1X01_SMD_3.25X0.85MM_NO_SILK]
JP749  M01PTH_SMD_3.25X0.85MM_NO_SILK  [1X01_SMD_3.25X0.85MM_NO_SILK]
JP750  M01PTH_SMD_3.25X0.85MM_NO_SILK  [1X01_SMD_3.25X0.85MM_NO_SILK]
JP751  M01PTH_SMD_3.25X0.85MM_NO_SILK  [1X01_SMD_3.25X0.85MM_NO_SILK]
JP752  M01PTH_SMD_3.25X0.85MM_NO_SILK  [1X01_SMD_3.25X0.85MM_NO_SILK]
JP753  M01PTH_SMD_3.25X0.85MM_NO_SILK  [1X01_SMD_3.25X0.85MM_NO_SILK]
JP754  M01PTH_SMD_3.25X0.85MM_NO_SILK  [1X01_SMD_3.25X0.85MM_NO_SILK]
JP755  M01PTH_SMD_3.25X0.85MM_NO_SILK  [1X01_SMD_3.25X0.85MM_NO_SILK]
JP756  M01PTH_SMD_3.25X0.85MM_NO_SILK  [1X01_SMD_3.25X0.85MM_NO_SILK]
JP757  M01PTH_SMD_3.25X0.85MM_NO_SILK  [1X01_SMD_3.25X0.85MM_NO_SILK]
JP758  M01PTH_SMD_3.25X0.85MM_NO_SILK  [1X01_SMD_3.25X0.85MM_NO_SILK]
JP759  M01PTH_SMD_3.25X0.85MM_NO_SILK  [1X01_SMD_3.25X0.85MM_NO_SILK]
JP760  M01PTH_SMD_3.25X0.85MM_NO_SILK  [1X01_SMD_3.25X0.85MM_NO_SILK]
JP761  M01PTH_SMD_3.25X0.85MM_NO_SILK  [1X01_SMD_3.25X0.85MM_NO_SILK]
JP762  M01PTH_SMD_3.25X0.85MM_NO_SILK  [1X01_SMD_3.25X0.85MM_NO_SILK]
JP763  M01PTH_SMD_3.25X0.85MM_NO_SILK  [1X01_SMD_3.25X0.85MM_NO_SILK]
JP764  M01PTH_SMD_3.25X0.85MM_NO_SILK  [1X01_SMD_3.25X0.85MM_NO_SILK]
JP765  M01PTH_SMD_3.25X0.85MM_NO_SILK  [1X01_SMD_3.25X0.85MM_NO_SILK]
JP766  M01PTH_SMD_3.25X0.85MM_NO_SILK  [1X01_SMD_3.25X0.85MM_NO_SILK]
JP767  M01PTH_SMD_3.25X0.85MM_NO_SILK  [1X01_SMD_3.25X0.85MM_NO_SILK]
JP768  M01PTH_SMD_3.25X0.85MM_NO_SILK  [1X01_SMD_3.25X0.85MM_NO_SILK]
JP769  M01PTH_SMD_3.25X0.85MM_NO_SILK  [1X01_SMD_3.25X0.85MM_NO_SILK]
JP770  M01PTH_SMD_3.25X0.85MM_NO_SILK  [1X01_SMD_3.25X0.85MM_NO_SILK]
JP771  M01PTH_SMD_3.25X0.85MM_NO_SILK  [1X01_SMD_3.25X0.85MM_NO_SILK]
JP772  M01PTH_SMD_3.25X0.85MM_NO_SILK  [1X01_SMD_3.25X0.85MM_NO_SILK]
JP773  M01PTH_SMD_3.25X0.85MM_NO_SILK  [1X01_SMD_3.25X0.85MM_NO_SILK]
JP774  M01PTH_SMD_3.25X0.85MM_NO_SILK  [1X01_SMD_3.25X0.85MM_NO_SILK]
JP775  M01PTH_SMD_3.25X0.85MM_NO_SILK  [1X01_SMD_3.25X0.85MM_NO_SILK]
JP776  M01PTH_SMD_3.25X0.85MM_NO_SILK  [1X01_SMD_3.25X0.85MM_NO_SILK]
JP777  M01PTH_SMD_3.25X0.85MM_NO_SILK  [1X01_SMD_3.25X0.85MM_NO_SILK]
JP778  M01PTH_SMD_3.25X0.85MM_NO_SILK  [1X01_SMD_3.25X0.85MM_NO_SILK]
JP779  M01PTH_SMD_3.25X0.85MM_NO_SILK  [1X01_SMD_3.25X0.85MM_NO_SILK]
JP780  M01PTH_SMD_3.25X0.85MM_NO_SILK  [1X01_SMD_3.25X0.85MM_NO_SILK]
JP781  M01PTH_SMD_3.25X0.85MM_NO_SILK  [1X01_SMD_3.25X0.85MM_NO_SILK]
JP782  M01PTH_SMD_3.25X0.85MM_NO_SILK  [1X01_SMD_3.25X0.85MM_NO_SILK]
JP783  M01PTH_SMD_3.25X0.85MM_NO_SILK  [1X01_SMD_3.25X0.85MM_NO_SILK]
JP784  M01PTH_SMD_3.25X0.85MM_NO_SILK  [1X01_SMD_3.25X0.85MM_NO_SILK]
JP785  M01PTH_SMD_3.25X0.85MM_NO_SILK  [1X01_SMD_3.25X0.85MM_NO_SILK]
JP786  M01PTH_SMD_3.25X0.85MM_NO_SILK  [1X01_SMD_3.25X0.85MM_NO_SILK]
JP787  M01PTH_SMD_3.25X0.85MM_NO_SILK  [1X01_SMD_3.25X0.85MM_NO_SILK]
JP788  M01PTH_SMD_3.25X0.85MM_NO_SILK  [1X01_SMD_3.25X0.85MM_NO_SILK]
JP789  M01PTH_SMD_3.25X0.85MM_NO_SILK  [1X01_SMD_3.25X0.85MM_NO_SILK]
JP790  M01PTH_SMD_3.25X0.85MM_NO_SILK  [1X01_SMD_3.25X0.85MM_NO_SILK]
JP791  M01PTH_SMD_3.25X0.85MM_NO_SILK  [1X01_SMD_3.25X0.85MM_NO_SILK]
JP792  M01PTH_SMD_3.25X0.85MM_NO_SILK  [1X01_SMD_3.25X0.85MM_NO_SILK]
JP793  M01PTH_SMD_3.25X0.85MM_NO_SILK  [1X01_SMD_3.25X0.85MM_NO_SILK]
JP794  M01PTH_SMD_3.25X0.85MM_NO_SILK  [1X01_SMD_3.25X0.85MM_NO_SILK]
JP795  M01PTH_SMD_3.25X0.85MM_NO_SILK  [1X01_SMD_3.25X0.85MM_NO_SILK]
JP796  M01PTH_SMD_3.25X0.85MM_NO_SILK  [1X01_SMD_3.25X0.85MM_NO_SILK]
JP797  M01PTH_SMD_3.25X0.85MM_NO_SILK  [1X01_SMD_3.25X0.85MM_NO_SILK]
JP798  M01PTH_SMD_3.25X0.85MM_NO_SILK  [1X01_SMD_3.25X0.85MM_NO_SILK]
JP799  M01PTH_SMD_3.25X0.85MM_NO_SILK  [1X01_SMD_3.25X0.85MM_NO_SILK]
JP800  M01PTH_SMD_3.25X0.85MM_NO_SILK  [1X01_SMD_3.25X0.85MM_NO_SILK]
JP801  M01PTH_SMD_3.25X0.85MM_NO_SILK  [1X01_SMD_3.25X0.85MM_NO_SILK]
JP802  M01PTH_SMD_3.25X0.85MM_NO_SILK  [1X01_SMD_3.25X0.85MM_NO_SILK]